# EAGLE design driver (EAGLE 9.6.2)
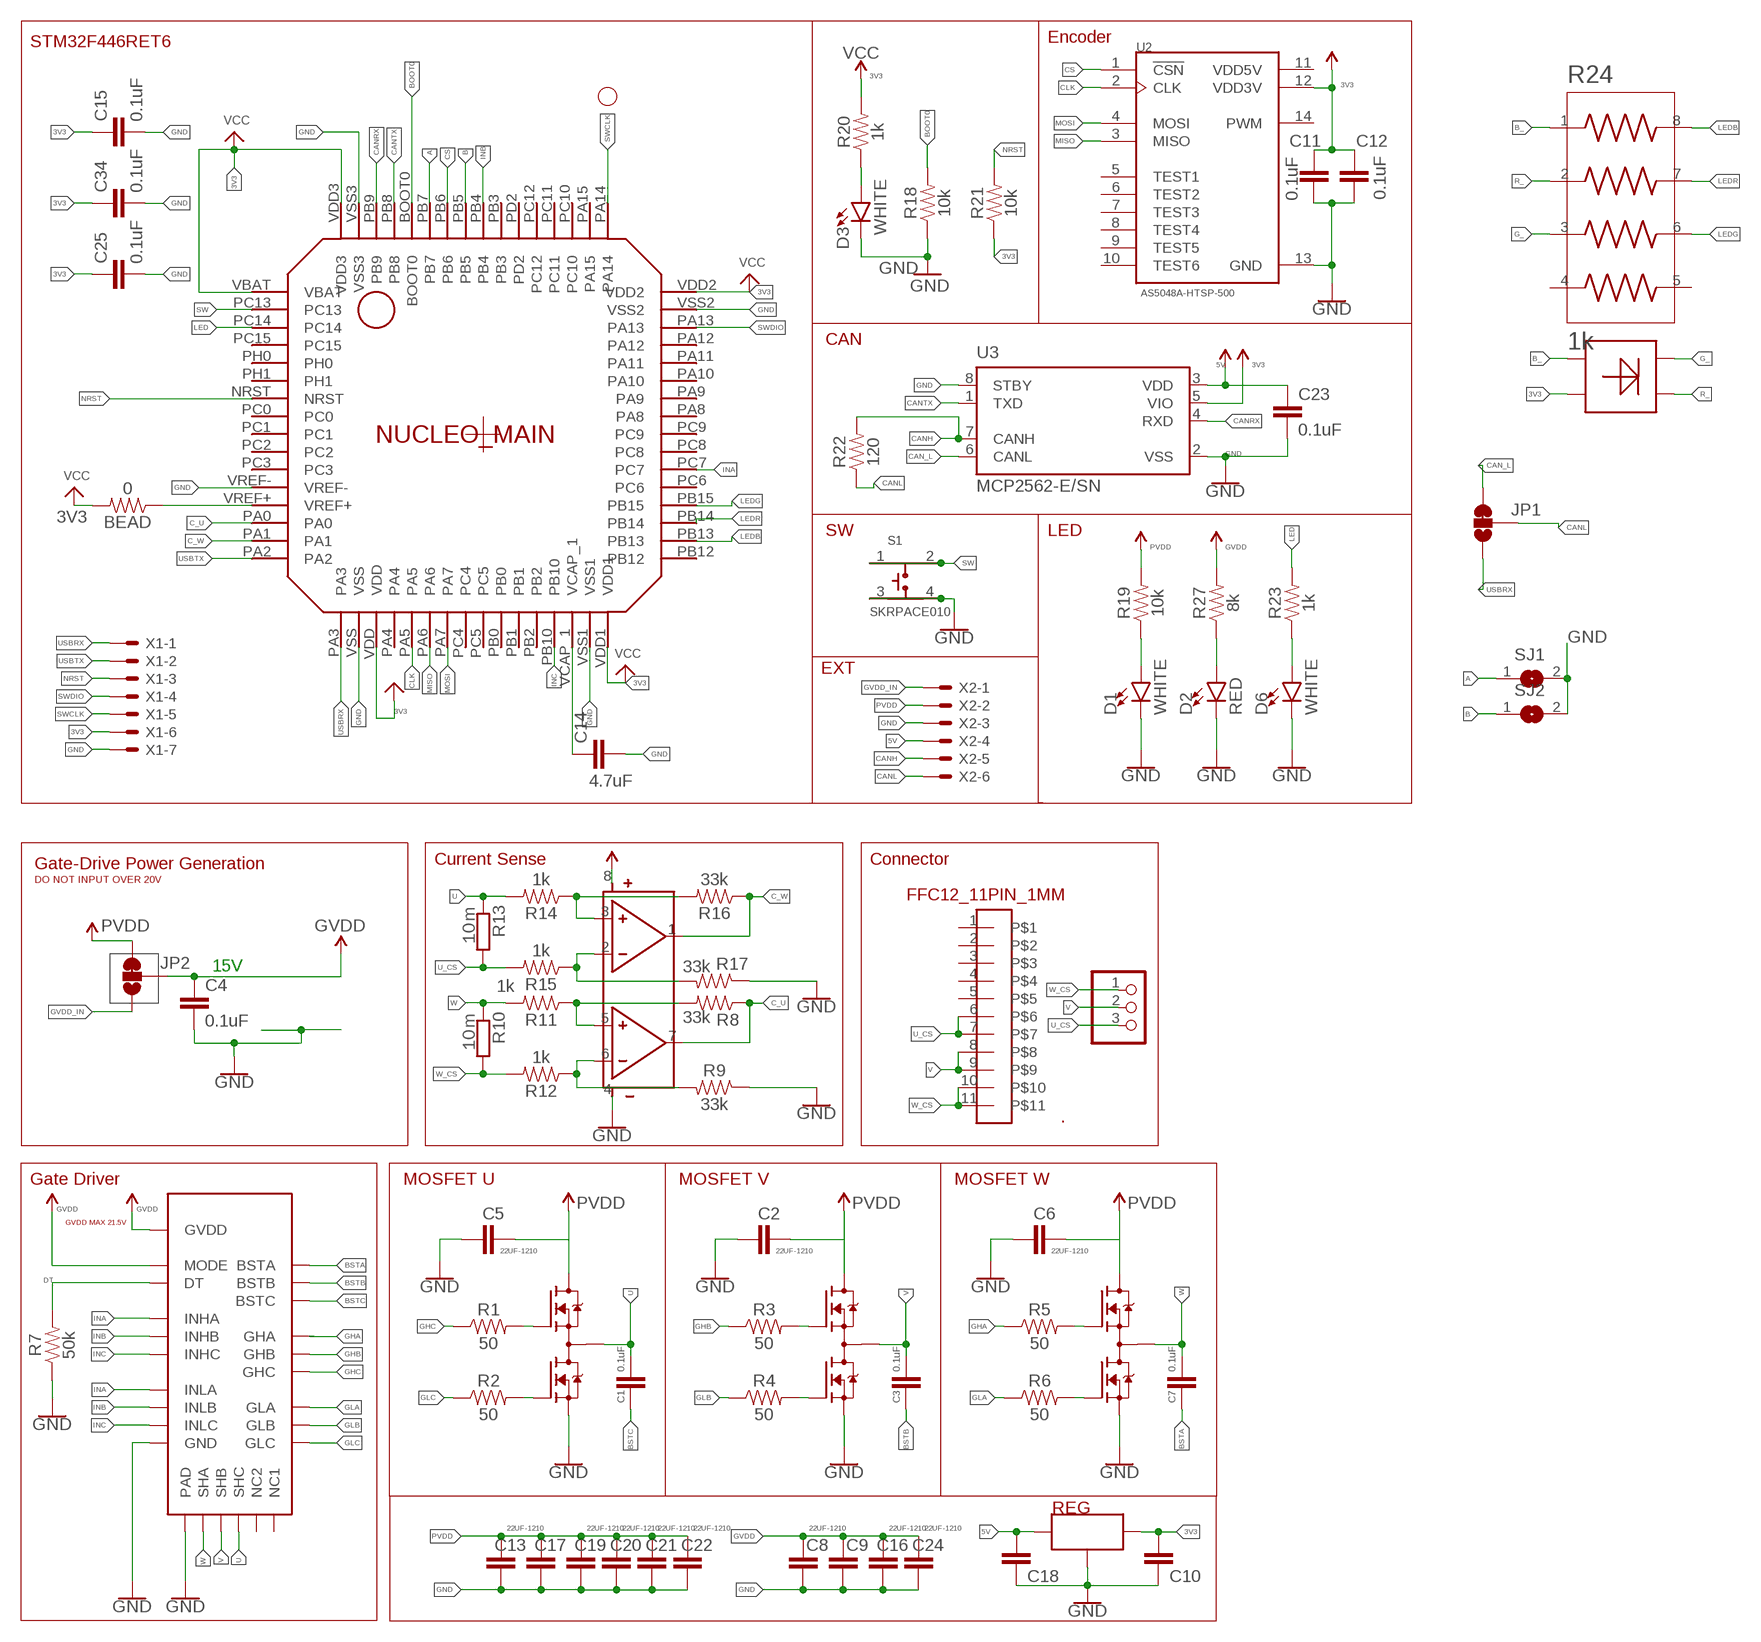
[diagram p0: schematic, sheet 1]

## Parts
.  FFC12_11PIN_1MM  [CON-SMT-FFCFPC_52207-1185]
BEAD  0  0OHM-0603-1/10W-5%  [0603]
C1  0.1uF  0.1UF-0603-25V-5%  [0603]
C2  22UF-1210  22UF-1210-16V-20%  [1210]
C3  0.1uF  0.1UF-0603-25V-5%  [0603]
C4  0.1uF  0.1UF-0603-100V-10%  [0603]
C5  22UF-1210  22UF-1210-16V-20%  [1210]
C6  22UF-1210  22UF-1210-16V-20%  [1210]
C7  0.1uF  0.1UF-0603-25V-5%  [0603]
C8  22UF-1210  22UF-1210-16V-20%  [1210]
C9  22UF-1210  22UF-1210-16V-20%  [1210]
C10  0.1UF  0.1UF_1608  [1608]
C11  0.1uF  0.1UF-0603-100V-10%  [0603]
C12  0.1uF  0.1UF-0603-100V-10%  [0603]
C13  22UF-1210  22UF-1210-16V-20%  [1210]
C14  4.7uF  0.1UF-0603-25V-(+80/-20%)  [0603]
C15  0.1uF  0.1UF-0603-25V-(+80/-20%)  [0603]
C16  22UF-1210  22UF-1210-16V-20%  [1210]
C17  22UF-1210  22UF-1210-16V-20%  [1210]
C18  0.1UF  0.1UF_1608  [1608]
C19  22UF-1210  22UF-1210-16V-20%  [1210]
C20  22UF-1210  22UF-1210-16V-20%  [1210]
C21  22UF-1210  22UF-1210-16V-20%  [1210]
C22  22UF-1210  22UF-1210-16V-20%  [1210]
C23  0.1uF  0.1UF-0603-100V-10%  [0603]
C24  22UF-1210  22UF-1210-16V-20%  [1210]
C25  0.1uF  0.1UF-0603-25V-(+80/-20%)  [0603]
C34  0.1uF  0.1UF-0603-25V-(+80/-20%)  [0603]
D1  WHITE  LED-WHITE0603  [LED-0603]
D2  RED  LED-RED0603  [LED-0603]
D3  WHITE  LED-WHITE0603  [LED-0603]
D6  WHITE  LED-WHITE0603  [LED-0603]
JP1  JUMPER-SMT_3_1-NC_TRACE_SILK  [SMT-JUMPER_3_1-NC_TRACE_SILK]
JP2  JUMPER-SMT_3_1-NC_TRACE_SILK  [SMT-JUMPER_3_1-NC_TRACE_SILK]
JP3  PINHD-1X3CB  [1X03-CLEANBIG]
NUCLEO_MAIN  F446RET6  STM32F446RET6  [STM32F446RET6]
Q2  SIZ240DT-T1-GE3  [TRANS_SIZ240DT-T1-GE3]
Q3  SIZ240DT-T1-GE3  [TRANS_SIZ240DT-T1-GE3]
Q4  SIZ240DT-T1-GE3  [TRANS_SIZ240DT-T1-GE3]
R1  50  1KOHM-0603-1/10W-1%  [0603]
R2  50  1KOHM-0603-1/10W-1%  [0603]
R3  50  1KOHM-0603-1/10W-1%  [0603]
R4  50  1KOHM-0603-1/10W-1%  [0603]
R5  50  1KOHM-0603-1/10W-1%  [0603]
R6  50  1KOHM-0603-1/10W-1%  [0603]
R7  50k  1KOHM-0603-1/10W-1%  [0603]
R8  33k  1KOHM-0603-1/10W-1%  [0603]
R9  33k  1KOHM-0603-1/10W-1%  [0603]
R10  10ｍ  SMS-REF  [SMS-REF]
R11  1k  1KOHM-0603-1/10W-1%  [0603]
R12  1k  1KOHM-0603-1/10W-1%  [0603]
R13  10ｍ  SMS-REF  [SMS-REF]
R14  1k  1KOHM-0603-1/10W-1%  [0603]
R15  1k  1KOHM-0603-1/10W-1%  [0603]
R16  33k  1KOHM-0603-1/10W-1%  [0603]
R17  33k  1KOHM-0603-1/10W-1%  [0603]
R18  10k  RESISTOR-0603-1/10W-1%  [R0603]
R19  10k  2.0KOHM-0603-1/10W-5%  [0603]
R20  1k  RESISTOR-0603-1/10W-1%  [R0603]
R21  10k  RESISTOR-0603-1/10W-1%  [R0603]
R22  120  2.0KOHM-0603-1/10W-5%  [0603]
R23  1k  2.0KOHM-0603-1/10W-5%  [0603]
R24  1k  MNR04M0APJ334  [RESCAXS50P200X100X45-8N]
R27  8k  2.0KOHM-0603-1/10W-5%  [0603]
REG  AP7333  [SOT95P237X112-3N]
S1  SKRPACE010  [SW_SKRPACE010]
SJ1  SJ  [SJ]
SJ2  SJ  [SJ]
U1  QFN50P400X400X100-25NDRV8300DRGER  [QFN50P400X400X100-25N]
U2  AS5048A-HTSP-500  [SOP65P640X120-14N]
U3  MCP2562-E/SN  [SOIC127P600X175-8N]
U4  SOP80P620X125-8N  [SOP80P620X125-8N]
U$1  LED  [LED_AAA3528LSEKJ3ZGKQBKS]
X1  JST-XH-07-PIN-ROUND-PAD  [JST-XH-07-PACKAGE-ROUND-PAD]
X2  JST-XH-06-PIN-LONG-PAD  [JST-XH-06-PACKAGE-LONG-PAD]

## Nets
3V3: BEAD.2 C10.1 C11.1 C12.1 C15.1 C25.1 C34.1 NUCLEO_MAIN.VBAT NUCLEO_MAIN.VDD NUCLEO_MAIN.VDD1 NUCLEO_MAIN.VDD2 NUCLEO_MAIN.VDD3 R20.2 R21.1 REG.2(OUT) U2.12(VDD3V) U3.5(VIO) U4.8(VDD) U$1.4(GND) X1.6 ; supply symbol labelled GVDD, PVDD, VCC
5V: C18.1 C23.1 REG.1(IN) U3.3(VDD) X2.4 ; supply symbol labelled GVDD
A: NUCLEO_MAIN.PB7 SJ1.1
B: NUCLEO_MAIN.PB5 SJ2.1
B_: R24.1 U$1.1(B)
BOOT0: NUCLEO_MAIN.BOOT0 R18.2
BSTA: C7.1 U1.BSTA
BSTB: C3.1 U1.BSTB
BSTC: C1.1 U1.BSTC
C_U: NUCLEO_MAIN.PA0 R8.1 U4.7(O2)
C_W: NUCLEO_MAIN.PA1 R16.1 U4.1(O1)
CAN_L: JP1.3 U3.6(CANL)
CANH: R22.2 U3.7(CANH) X2.5
CANL: JP1.2 R22.1 X2.6
CANRX: NUCLEO_MAIN.PB9 U3.4(RXD)
CANTX: NUCLEO_MAIN.PB8 U3.1(TXD)
CLK: NUCLEO_MAIN.PA5 U2.2(CLK)
CS: NUCLEO_MAIN.PB6 U2.1(!CSN)
DT: R7.2 U1.DT
G_: R24.3 U$1.2(G)
GHA: R5.1 U1.GHA
GHB: R3.1 U1.GHB
GHC: R1.1 U1.GHC
GLA: R6.1 U1.GLA
GLB: R4.1 U1.GLB
GLC: R2.1 U1.GLC
GND: C2.1 C4.2 C5.1 C6.1 C8.1 C9.1 C10.2 C11.2 C12.2 C13.1 C14.2 C15.2 C16.1 C17.1 C18.2 C19.1 C20.1 C21.1 C22.1 C23.2 C24.1 C25.2 C34.2 D1.C D2.C D3.C D6.C NUCLEO_MAIN.VREF- NUCLEO_MAIN.VSS NUCLEO_MAIN.VSS1 NUCLEO_MAIN.VSS2 NUCLEO_MAIN.VSS3 Q2.5(S2) Q2.6(S2) Q2.7(S2) Q3.5(S2) Q3.6(S2) Q3.7(S2) Q4.5(S2) Q4.6(S2) Q4.7(S2) R7.1 R9.1 R17.1 R18.1 REG.3(GND) S1.3 S1.4 SJ1.2 SJ2.2 U1.GND U1.PAD U2.13(GND) U3.2(VSS) U3.8(STBY) U4.4(GND) X1.7 X2.3
GVDD: C4.1 C8.2 C9.2 C16.2 C24.2 JP2.2 R27.2 U1.GVDD U1.MODE ; supply symbol labelled PVDD
GVDD_IN: JP2.1 X2.1
HA: Q4.1(G1) R5.2
HB: Q3.1(G1) R3.2
HC: Q2.1(G1) R1.2
INA: NUCLEO_MAIN.PC7 U1.INHA U1.INLA
INB: NUCLEO_MAIN.PB4 U1.INHB U1.INLB
INC: NUCLEO_MAIN.PB10 U1.INHC U1.INLC
L: D3.A R20.1
LA: Q4.8(G2) R6.2
LB: Q3.8(G2) R4.2
LC: Q2.8(G2) R2.2
LED: NUCLEO_MAIN.PC14 R23.2
LEDB: NUCLEO_MAIN.PB13 R24.8
LEDG: NUCLEO_MAIN.PB15 R24.6
LEDR: NUCLEO_MAIN.PB14 R24.7
MISO: NUCLEO_MAIN.PA6 U2.3(MISO)
MOSI: NUCLEO_MAIN.PA7 U2.4(MOSI)
N$8: R8.2 R11.1 U4.5(P2)
N$9: R9.2 R12.1 U4.6(M2)
N$10: R14.1 R16.2 U4.3(P1)
N$11: R15.1 R17.2 U4.2(M1)
N$14: D1.A R19.1
N$15: D2.A R27.1
N$21: D6.A R23.1
NRST: NUCLEO_MAIN.NRST R21.2 X1.3
PVDD: C2.2 C5.2 C6.2 C13.2 C17.2 C19.2 C20.2 C21.2 C22.2 JP2.3 Q2.2(D1) Q2.3(D1) Q2.4(D1) Q2.10(D1) Q3.2(D1) Q3.3(D1) Q3.4(D1) Q3.10(D1) Q4.2(D1) Q4.3(D1) Q4.4(D1) Q4.10(D1) R19.2 X2.2 ; supply symbol labelled GVDD
R_: R24.2 U$1.3(R)
SW: NUCLEO_MAIN.PC13 S1.1 S1.2
SWCLK: NUCLEO_MAIN.PA14 X1.5
SWDIO: NUCLEO_MAIN.PA13 X1.4
U: C1.2 Q2.9(S1/D2) R13.2 R14.2 U1.SHC
U_CS: ..6 ..7 JP3.3 R13.1 R15.2
USBRX: JP1.1 NUCLEO_MAIN.PA3 X1.1
USBTX: NUCLEO_MAIN.PA2 X1.2
V: ..8 ..9 C3.2 JP3.2 Q3.9(S1/D2) U1.SHB
VCAP: C14.1 NUCLEO_MAIN.VCAP_1
VDDA: BEAD.1 NUCLEO_MAIN.VREF+
W: C7.2 Q4.9(S1/D2) R10.2 R11.2 U1.SHA
W_CS: ..10 ..11 JP3.1 R10.1 R12.2
Unconnected: ..1 ..2 ..3 ..4 ..5 NUCLEO_MAIN.PA4 NUCLEO_MAIN.PA8 NUCLEO_MAIN.PA9 NUCLEO_MAIN.PA10 NUCLEO_MAIN.PA11 NUCLEO_MAIN.PA12 NUCLEO_MAIN.PA15 NUCLEO_MAIN.PB0 NUCLEO_MAIN.PB1 NUCLEO_MAIN.PB2 NUCLEO_MAIN.PB3 NUCLEO_MAIN.PB12 NUCLEO_MAIN.PC0 NUCLEO_MAIN.PC1 NUCLEO_MAIN.PC2 NUCLEO_MAIN.PC3 NUCLEO_MAIN.PC4 NUCLEO_MAIN.PC5 NUCLEO_MAIN.PC6 NUCLEO_MAIN.PC8 NUCLEO_MAIN.PC9 NUCLEO_MAIN.PC10 NUCLEO_MAIN.PC11 NUCLEO_MAIN.PC12 NUCLEO_MAIN.PC15 NUCLEO_MAIN.PD2 NUCLEO_MAIN.PH0 NUCLEO_MAIN.PH1 R24.4 R24.5 U1.NC1 U1.NC2 U2.5(TEST1) U2.6(TEST2) U2.7(TEST3) U2.8(TEST4) U2.9(TEST5) U2.10(TEST6) U2.14(PWM)

## Notes on the sheet
- STM32F446RET6 | Encoder
- CAN
- SW | LED
- Recommended
- EXT
- Gate-Drive Power Generation | Current Sense | Connector
- DO NOT INPUT OVER 20V
- 15V
- Gate Driver | MOSFET U | MOSFET V | MOSFET W
- GVDD MAX 21.5V

## Power pins joined to a net without a drawn wire
VDD5V: U2.11(VDD5V)

## Library data of the parts
. = MotorDriver_FourthEdition_prot:FFC12_11PIN_1MM
BEAD = SparkFun-Resistors:0OHM: 0Ω resistor A resistor is a passive two-terminal electrical component that implements electrical resistance as a circuit element. Resistors act to reduce current flow, and, at the same time, act to lower voltage levels within circuits. - Wikipedia; PROD_ID: RES-08609
C1 C3 C7 = SparkFun-Capacitors:0.1UF: 0.1µF ceramic capacitors A capacitor is a passive two-terminal electrical component used to store electrical energy temporarily in an electric field.; PROD_ID: CAP-08604
C2 C5 C6 C8 C9 C13 C16 C17 C19-C22 C24 = SparkFun-Capacitors:22UF: 22µF ceramic capacitors A capacitor is a passive two-terminal electrical component used to store electrical energy temporarily in an electric field.
C4 C11 C12 C23 = SparkFun-Capacitors:0.1UF: 0.1µF ceramic capacitors A capacitor is a passive two-terminal electrical component used to store electrical energy temporarily in an electric field.; PROD_ID: CAP-08390
C10 C18 = Custom_Designed_By_Yusei:0.1UF_1608
C14 = SparkFun-Capacitors:0.1UF: 0.1µF ceramic capacitors A capacitor is a passive two-terminal electrical component used to store electrical energy temporarily in an electric field.; PROD_ID: CAP-00810; VALUE: 0.1uF
C15 C25 C34 = SparkFun-Capacitors:0.1UF: 0.1µF ceramic capacitors A capacitor is a passive two-terminal electrical component used to store electrical energy temporarily in an electric field.; PROD_ID: CAP-00810
D1 D3 D6 = SparkFun-LED:LED-WHITE: White SMD LED Used in manufacturing several products at SparkFun. Packages: 0603 - Bright White SMD 0603 package[Product Link] <http://www.kingbrightusa.com/product.asp?catalog_name=LED&product_id=APT1608QWF/D> 1206 - Bright White SMD1206 package [Product Link] <http://www.kingbrightusa.com/product.asp?catalog_name=LED&product_id=APT3216QWF/D> 3014 - Super Bright SMD 3014 package [Datasheet] <http://www.lumileds.com/uploads/459/DS208-pdf> SparkFun Products: Blackberry Trackballer Breakout <https://www.sparkfun.com/products/13169> Digital SandBox <https://www.sparkfun.com/products/12651>; PROD_ID: DIO-09004
D2 = SparkFun-LED:LED-RED: Red SMD LED Used in manufacturing of most products at SparkFun Packages: 0603 - SMD 0603 package [Product Link] <http://docs.avagotech.com/docs/AV02-0551EN> 0603 SMART - SMD 0603 SMART package ( more efficient and expensive)[Product Link] <http://www.osram-os.com/Graphics/XPic2/00077099_0.pdf> 1206 - SMD1206 package [Product Link] <https://www.sparkfun.com/datasheets/DevTools/LilyPad/Q150OVS4.pdff> SparkFun Products: Pro Mini 328 -5V <https://www.sparkfun.com/products/821> RedBoard <https://www.sparkfun.com/products/12757> IOIO-OTG <https://www.sparkfun.com/products/13613>; PROD_ID: DIO-00819
JP1 JP2 = SparkFun-Jumpers:JUMPER-SMT_3_1-NC_TRACE: Normally closed trace jumper (1 of 2 connections) This jumper has a trace between two pads so it's normally closed (NC). The other connection is normally open (NO). Use a razor knife to open the connection. For best results follow the IPC guidelines for cutting traces: Cutout at least 0.063 mm (0.005 in). Remove all loose material to clean up the cut area. Seal the cut with an approved epoxy. Reapply solder to reclose the connection, or to close the NO connection.
JP3 = adafruit:PINHD-1X3: PIN HEADER
NUCLEO_MAIN = STM32F446RET6:STM32F446RET6
Q2-Q4 = SIZ240DT-T1-GE3:SIZ240DT-T1-GE3: Check availability <https://pricing.snapeda.com/parts/SIZ240DT-T1-GE3/Vishay%20Siliconix/view-part?ref=eda>; AVAILABILITY: In Stock; DESCRIPTION: Mosfet Array 2 N-Channel (Dual) 40V 17.2A (Ta), 48A (Tc), 16.9A (Ta), 47A (Tc) 4.3W (Ta), 33W (Tc) Surface Mount 8-PowerPair® (3.3x3.3); MF: Vishay Siliconix; MP: SIZ240DT-T1-GE3; PACKAGE: PowerWDFN-8 Vishay Siliconix; PRICE: None; PURCHASE-URL: https://pricing.snapeda.com/search/part/SIZ240DT-T1-GE3/?ref=eda
R1-R9 R16 R17 = SparkFun-Resistors:1KOHM: 1kΩ resistor A resistor is a passive two-terminal electrical component that implements electrical resistance as a circuit element. Resistors act to reduce current flow, and, at the same time, act to lower voltage levels within circuits. - Wikipedia; PROD_ID: RES-07856; VALUE: 1k
R10 R13 = resistor-shunt:SMS-REF: SMD SHUNT RESISTOR; OC_FARNELL: unknown; OC_NEWARK: unknown
R11 R12 R14 R15 = SparkFun-Resistors:1KOHM: 1kΩ resistor A resistor is a passive two-terminal electrical component that implements electrical resistance as a circuit element. Resistors act to reduce current flow, and, at the same time, act to lower voltage levels within circuits. - Wikipedia; PROD_ID: RES-07856
R18 R21 = Custom_Designed_By_Yusei:RESISTOR: Resistor; PROD_ID: RES-07856; VALUE: 1k
R19 R22 R23 R27 = SparkFun-Resistors:2.0KOHM: 2kΩ resistor A resistor is a passive two-terminal electrical component that implements electrical resistance as a circuit element. Resistors act to reduce current flow, and, at the same time, act to lower voltage levels within circuits. - Wikipedia; PROD_ID: RES-08296; VALUE: 2.0k
R20 = Custom_Designed_By_Yusei:RESISTOR: Resistor; PROD_ID: RES-07856
R24 = MNR04M0APJ334:MNR04M0APJ334: Res Array 330K Ohm 5% ±200ppm/°C ISOL Epoxy 8-Pin 0804(4 X 0402) Convex SMD Automotive T/R Check availability <https://pricing.snapeda.com/parts/MNR04M0APJ334/Rohm/view-part?ref=eda>; AVAILABILITY: In Stock; DESCRIPTION: Res Array 330K Ohm 5% ±200ppm/°C ISOL Epoxy 8-Pin 0804(4 X 0402) Convex SMD Automotive T/R; MF: Rohm; MP: MNR04M0APJ334; PACKAGE: 0402 Rohm; PRICE: None
REG = SOT95P237X112-3N:AP7333
S1 = Alps SW:SKRPACE010: Switch Tactile N.O. SPST Button J-Bend 0.05A 16VDC 2.55N SMD Automotive T/R; AVAILABILITY: Good; DESCRIPTION: Switch Tactile N.O. SPST Button J-Bend 0.05A 16VDC 2.55N SMD Automotive T/R; MF: ALPS; MP: SKRPACE010; PACKAGE: None; PRICE: 0.29 USD
SJ1 SJ2 = jumper:SJ: SMD solder JUMPER
U1 = DRV8300DRGER:QFN50P400X400X100-25N: DRV8300
U2 = AS5048A-HTSP-500:AS5048A-HTSP-500: AS5048B Series 360° 3.3 / 5 V 14 bit Magnetic Rotary Encoder - TSSOP-14 Check availability <https://pricing.snapeda.com/parts/AS5048A-HTSP-500/ams/view-part?ref=eda>; AVAILABILITY: In Stock; DESCRIPTION: Hall Effect Sensor Angle External Magnet, Not Included Gull Wing; MF: ams; MP: AS5048A-HTSP-500; PACKAGE: TSSOP-14 ams; PRICE: None; PURCHASE-URL: https://pricing.snapeda.com/search/part/AS5048A-HTSP-500/?ref=eda
U3 = MCP2562-E_SN:MCP2562-E/SN: MCP2562 Series 5 V Surface Mount High-Speed CAN Transceiver - SOIC-8 Check availability <https://pricing.snapeda.com/parts/MCP2562-E/SN/Microchip/view-part?ref=eda>; AVAILABILITY: In Stock; DESCRIPTION: 1/1 Transceiver Half CANbus 8-SOIC; MF: Microchip; MP: MCP2562-E/SN; PACKAGE: SO-8 Microchip; PRICE: None; PURCHASE-URL: https://pricing.snapeda.com/search/part/MCP2562-E/SN/?ref=eda
U4 = NJM2732:SOP80P620X125-8N; A1_MIN: 0.0; A_MAX: 1.25; A_MIN: 1.25; A_NOM: 1.25; B_MAX: 0.35; B_MIN: 0.35; B_NOM: 0.35; D2_MAX: 0.0; D_MAX: 3.5; D_MIN: 3.5; D_NOM: 3.5; E1_MAX: 4.2; E1_MIN: 4.2; E1_NOM: 4.2; E2_MAX: 0.0; ENOM: 0.8; E_MAX: 6.2; E_MIN: 6.2; E_NOM: 6.2; L_MAX: 0.5; L_MIN: 0.5; L_NOM: 0.5; MANUFACTURER: New Japan Radio; PIN_COUNT: 8.0; SNAPEDA_PACKAGE_ID: 11524; STANDARD: IPC 7351B
U$1 = LED_AAA3528LSEKJ3ZGKQBKS:LED
X1 = JST XH Connectors:JST-XH-07-PIN: JST XH Connector 2 Pin Wire to board connector. Pitch: 2,54 mm, (0.100") Number of pins: 7 Created by Rembrandt Electronics www.rembrandtelectronics.com
X2 = Rembrandt Electronics - JST XH Connectors v1-0:JST-XH-06-PIN: JST XH Connector 2 Pin Wire to board connector. Pitch: 2,54 mm, (0.100") Number of pins: 6 Created by Rembrandt Electronics www.rembrandtelectronics.com

## Net classes
0 default: width 0.3 mm

## Board
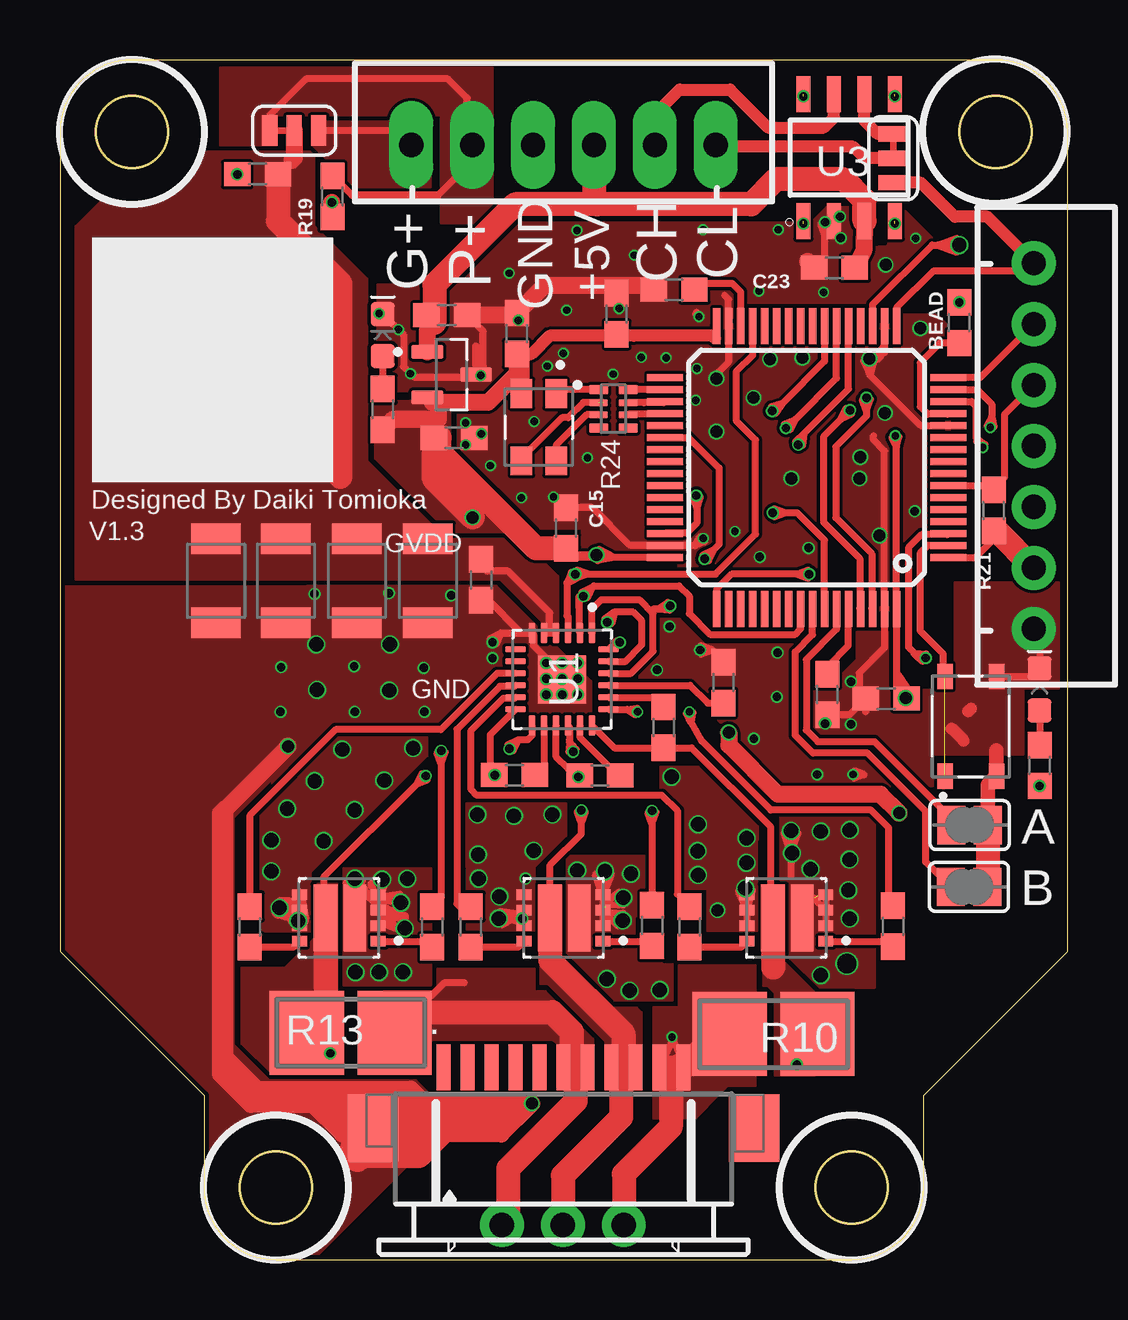
[diagram p1: board, top side]
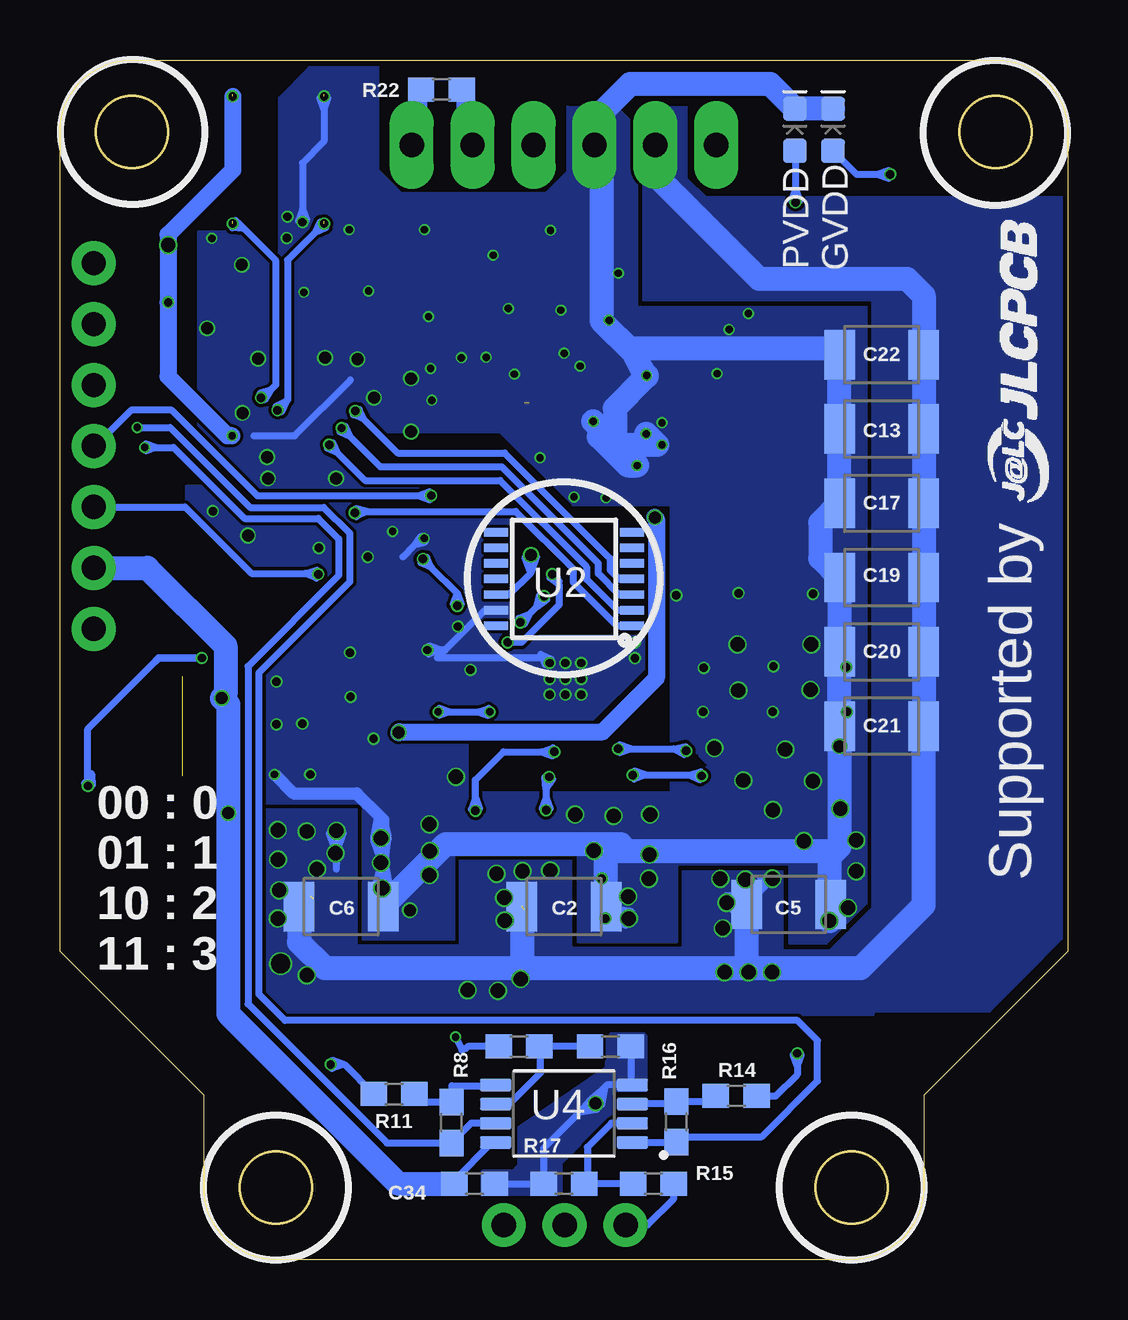
[diagram p2: board, bottom side, seen from below]

Size 42 x 50 mm. Coordinates in mm from the lower left corner, seen from the top.
Outline: 3,50 arc90 0,47 0,12.85 6,6.85 6,3 arc90 9,0 33,0 arc90 36,3 36,6.85 42,12.85 42,47 arc90 39,50 3,50
Outline: circle at 3,47 radius 1.5
Outline: circle at 39,47 radius 1.5
Outline: circle at 9,3 radius 1.5
Outline: circle at 33,3 radius 1.5
Outline: circle at 39,47 radius 1.5
Copper layers (1*16): Top 0.035mm / dielectric 1.6mm / Bottom 0.035mm
Design rules "jlcpcb-2layers": minimum track width 5mil, minimum drill 0.3mm, track to track 5mil, track to pad 5mil, pad to pad 5mil, via to via 5mil, smd to smd 5mil, copper to edge 0.2mm, drill to drill 6mil, minimum pad ring 10mil, minimum via ring 3mil, stop-mask expansion 4mil, vias tented up to drill 0mil, thermal gap 10mil
tRestrict: area 6,0 to 12,6; area 30,0 to 36,6; area 0,44 to 6,50; area 36,44 to 42,50; 5 lines
bRestrict: area 0,44 to 6,50; area 36,44 to 42,50; 2 lines

### Footprints (pad centres in the part's own frame; a part is rotated, then mirrored left to right if it is on the bottom)
CON-SMT-FFCFPC_52207-1185 = smd 0.6 x 1.9: 1 -5,2.5; 2 -4,2.5; 3 -3,2.5; 4 -2,2.5; 5 -1,2.5; 6 0,2.5; 7 1,2.5; 8 2,2.5; 9 3,2.5; 10 4,2.5; 11 5,2.5 | smd 2.1 x 2.8: P$1 -7.93,-0.03; P$4 7.945,-0.03
0603 = smd 1.1 x 1: 1 -0.85,0; 2 0.85,0
1210 = smd 1.27 x 2.06: 1 -1.755,0; 2 1.755,0
1608 = smd 1.1 x 1: 1 -0.85,0; 2 0.85,0
LED-0603 = smd 1 x 1: A -0.877,0; C 0.877,0
SMT-JUMPER_3_1-NC_TRACE_SILK = smd 0.635 x 1.27: 1 -1.016,0; 2 0,0; 3 1.016,0
1X03-CLEANBIG = drill 1.016 pad 1.676: 1 -2.54,0; 2 0,0; 3 2.54,0
STM32F446RET6 = smd 0.3 x 1.5: BOOT0 -1.75,5.9; PA3 -3.75,-5.9; PA4 -2.25,-5.9; PA5 -1.75,-5.9; PA6 -1.25,-5.9; PA7 -0.75,-5.9; PA14 3.75,5.9; PA15 3.25,5.9; PB0 0.75,-5.9; PB1 1.25,-5.9; PB2 1.75,-5.9; PB3 0.75,5.9; PB4 0.25,5.9; PB5 -0.25,5.9; PB6 -0.75,5.9; PB7 -1.25,5.9; PB8 -2.25,5.9; PB9 -2.75,5.9; PB10 2.25,-5.9; PC4 -0.25,-5.9; PC5 0.25,-5.9; PC10 2.75,5.9; PC11 2.25,5.9; PC12 1.75,5.9; PD2 1.25,5.9; VCAP_1 2.75,-5.9; VDD -2.75,-5.9; VDD1 3.75,-5.9; VDD3 -3.75,5.9; VSS -3.25,-5.9; VSS1 3.25,-5.9; VSS3 -3.25,5.9 | smd 1.5 x 0.3: NRST -5.9,0.75; PA0 -5.9,-2.75; PA1 -5.9,-3.25; PA2 -5.9,-3.75; PA8 5.9,0.25; PA9 5.9,0.75; PA10 5.9,1.25; PA11 5.9,1.75; PA12 5.9,2.25; PA13 5.9,2.75; PB12 5.9,-3.75; PB13 5.9,-3.25; PB14 5.9,-2.75; PB15 5.9,-2.25; PC0 -5.9,0.25; PC1 -5.9,-0.25; PC2 -5.9,-0.75; PC3 -5.9,-1.25; PC6 5.9,-1.75; PC7 5.9,-1.25; PC8 5.9,-0.75; PC9 5.9,-0.25; PC13 -5.9,3.25; PC14 -5.9,2.75; PC15 -5.9,2.25; PH0 -5.9,1.75; PH1 -5.9,1.25; VBAT -5.9,3.75; VDD2 5.9,3.75; VREF+ -5.9,-2.25; VREF- -5.9,-1.75; VSS2 5.9,3.25
TRANS_SIZ240DT-T1-GE3 = smd 0.62 x 0.44: 1 -1.64,0.975; 2 -1.64,0.325; 3 -1.64,-0.325; 4 -1.64,-0.975; 5 1.64,-0.975; 6 1.64,-0.325; 7 1.64,0.325; 8 1.64,0.975 | smd 1.005 x 2.8: 9 0.557,0 | smd 0.935 x 2.8: 10 -0.662,0
SMS-REF = smd 3.1 x 3.5: 1 1.829,0; 2 -1.829,0
R0603 = smd 1.1 x 1: 1 -0.85,0; 2 0.85,0
RESCAXS50P200X100X45-8N = smd 0.79 x 0.39: 1 -0.62,0.8; 4 -0.62,-0.8; 5 0.62,-0.8; 8 0.62,0.8 | smd 0.79 x 0.29: 2 -0.62,0.25; 3 -0.62,-0.25; 6 0.62,-0.25; 7 0.62,0.25
SOT95P237X112-3N = smd 1.32 x 0.59: 1 -1.015,0.95; 2 -1.015,-0.95; 3 1.015,0
SW_SKRPACE010 = smd 1.05 x 0.65: 1 -2.075,1.075; 2 2.075,1.075; 3 -2.075,-1.075; 4 2.075,-1.075
SJ = smd 1.168 x 1.6: 1 -0.762,0; 2 0.762,0
QFN50P400X400X100-25N = smd 0.27 x 0.86: BSTA 0.75,1.935; DT 0.25,1.935; GHA 1.25,1.935; GLA 0.75,-1.935; GLB 0.25,-1.935; GLC -0.25,-1.935; INHA -0.25,1.935; INHB -0.75,1.935; INHC -1.25,1.935; NC1 -1.25,-1.935; NC2 -0.75,-1.935; SHC 1.25,-1.935 | smd 0.86 x 0.27: BSTB 1.935,0.75; BSTC 1.935,-0.75; GHB 1.935,0.25; GHC 1.935,-1.25; GND -1.935,-1.25; GVDD -1.935,-0.25; INLA -1.935,1.25; INLB -1.935,0.75; INLC -1.935,0.25; MODE -1.935,-0.75; SHA 1.935,1.25; SHB 1.935,-0.25 | smd 2 x 2: PAD 0,0
SOP65P640X120-14N = smd 1 x 0.35: 1 -2.825,1.95; 2 -2.825,1.3; 3 -2.825,0.65; 4 -2.825,0; 5 -2.825,-0.65; 6 -2.825,-1.3; 7 -2.825,-1.95; 8 2.825,-1.95; 9 2.825,-1.3; 10 2.825,-0.65; 11 2.825,0; 12 2.825,0.65; 13 2.825,1.3; 14 2.825,1.95
SOIC127P600X175-8N = smd 1.5 x 0.6: 1 -2.65,1.905; 2 -2.65,0.635; 3 -2.65,-0.635; 4 -2.65,-1.905; 5 2.65,-1.905; 6 2.65,-0.635; 7 2.65,0.635; 8 2.65,1.905
SOP80P620X125-8N = smd 1.31 x 0.52: 1 -2.85,1.2; 2 -2.85,0.4; 3 -2.85,-0.4; 4 -2.85,-1.2; 5 2.85,-1.2; 6 2.85,-0.4; 7 2.85,0.4; 8 2.85,1.2
LED_AAA3528LSEKJ3ZGKQBKS = smd 1.2 x 0.9: 1 -1.4,0.725; 2 1.4,0.725; 3 1.4,-0.725; 4 -1.4,-0.725
JST-XH-07-PACKAGE-ROUND-PAD = drill 1.016: 1 -7.62,0; 2 -5.08,0; 3 -2.54,0; 4 0,0; 5 2.54,0; 6 5.08,0; 7 7.62,0
JST-XH-06-PACKAGE-LONG-PAD = drill 1.016 long: 1 -6.35,0; 2 -3.81,0; 3 -1.27,0; 4 1.27,0; 5 3.81,0; 6 6.35,0

### Placement (x,y rotation side)
.  20.99,5.51 0 top
BEAD  37.49,39.05 90 top
C1  18.95,20.19 180 top
C2  20.99,14.72 180 bottom
C3  22.51,20.18 180 top
C4  17.55,28.33 270 top
C5  11.62,14.8 180 bottom
C6  30.28,14.72 180 bottom
C7  25.16,22.18 270 top
C8  15.34,28.29 90 top
C9  12.38,28.29 90 top
C10  16.43,34.25 0 top
C11  34.44,23.39 180 top
C12  19.05,38.6 90 top
C13  7.75,34.62 0 bottom
C14  25.6,40.43 180 top
C15  21.1,30.49 90 top
C16  9.42,28.29 90 top
C17  7.75,31.52 0 bottom
C18  16.13,39.36 0 top
C19  7.75,28.43 0 bottom
C20  7.75,25.33 0 bottom
C21  7.75,22.23 0 bottom
C22  7.75,37.71 0 bottom
C23  32.28,41.33 180 top
C24  6.51,28.29 90 top
C25  23.21,39.41 90 top
C34  24.72,3.16 0 bottom
D1  11.36,47.09 90 bottom
D2  9.78,47.09 90 bottom
D3  13.45,38.53 90 top
D6  40.83,23.77 90 top
JP1  34.74,45.9 90 top
JP2  9.76,47.06 180 top
JP3  20.96,1.44 180 top
NUCLEO_MAIN  31.12,33.01 180 top
Q2  11.62,14.24 180 top
Q3  20.99,14.24 180 top
Q4  30.28,14.24 180 top
R1  15.52,13.87 270 top
R2  7.91,13.87 270 top
R3  24.68,13.92 270 top
R4  17.12,13.87 270 top
R5  34.72,13.89 270 top
R6  26.25,13.87 270 top
R7  27.65,24.05 270 top
R8  25.67,5.71 90 bottom
R9  19.06,8.88 180 bottom
R10  29.74,9.4 180 top
R11  28.07,6.91 180 bottom
R12  22.87,8.88 180 bottom
R13  12.12,9.46 0 top
R14  13.81,6.82 0 bottom
R15  17.26,3.16 0 bottom
R16  16.31,5.74 90 bottom
R17  20.99,3.16 0 bottom
R18  31.98,23.55 90 top
R19  11.36,44.31 90 top
R20  13.45,35.44 270 top
R21  38.93,31.23 90 top
R22  26.1,48.77 0 bottom
R23  40.83,20.59 270 top
R24  23.07,35.46 0 top
R27  8.24,45.24 0 top
REG  16.33,36.89 0 top
S1  37.96,22.22 90 top
SJ1  37.92,18.11 0 top
SJ2  37.89,15.53 0 top
U1  20.93,24.19 270 top
U2  20.99,28.37 180 bottom
U3  32.9,45.93 90 top
U4  20.99,6.08 180 bottom
U$1  19.96,34.69 270 top
X1  40.6,33.91 270 top
X2  20.99,46.47 0 top

### Tracks (layer width: path | path; a pad name or v marks a point on that pad's centre or on a via)
3V3  (via drill 0.3, 0.35, 0.5, 0.6)  (1 unrouted)
  Top 0.3: R21.1 39.07,30.23 39.13,30.23 38.16,29.27 NUCLEO_MAIN.VBAT | NUCLEO_MAIN.VDD1 27.37,38.45 27.31,38.39 | 15.78,35.67 15.73,35.72 | 15.53,35.72 REG.2 | 15.83,34.25 C10.1 | NUCLEO_MAIN.VDD2 23.11,29.27 | 23.11,29.27 21.47,29.27 C15.1 21.4,29.37 v22.37,29.37 | v34.83,34.34 34.87,34.29 34.87,33.88 | 34.87,33.88 NUCLEO_MAIN.VDD3 34.87,24.46 | 34.87,24.46 34.87,23.8 C11.1 | NUCLEO_MAIN.VDD 33.88,38.93 33.88,39.81 36.35,42.28 36.59,42.28 | 36.59,42.28 v37.49,42.28 | 23.11,29.27 22.48,29.6 v22.37,29.37 | 23.11,29.27 22.42,29.13 v22.37,29.37 | 34.87,33.88 34.98,34.3 v34.83,34.34 | 34.87,33.88 34.69,34.27 v34.83,34.34 | 35.07,24.18 35.02,23.42 v35.25,23.41 35.49,23.57 35.07,24.18 | 34.87,24.46 35.07,24.18 | 36.59,42.28 37.39,42 v37.49,42.28 | 36.59,42.28 37.39,42.57 v37.49,42.28 | C25.1 23.85,38.56 23.91,38.51
  Top 0.5: C12.1 19.65,37.75 20.41,38.51 23.91,38.51 27.19,38.51 27.31,38.39 | U$1.4 19.23,36.29
  Top 0.7: C10.1 15.58,35.03 | 15.78,35.67 15.78,35.03 15.58,35.03 | R20.2 13.89,35.03 15.58,35.03 | 15.53,35.72 15.73,35.72 17.84,35.72 19.05,36.93 C12.1 19.23,37.57 U$1.4 | v34.98,18.61 34.2,19.39 29.93,19.39 27.88,21.45 v27.88,21.97
  Top 1: v35.25,23.41 35.29,23.41 C11.1 | 15.83,33.43 15.83,34.25 | v17.2,30.93 15.58,32.56 C10.1 15.58,33.91 19.85,29.64 C15.1 | X1.6 39.05,30.38 R21.1
  Bottom 0.3: C34.1 25.57,3.29 23.98,4.88 U4.8 | U2.12 23.28,27.72 22.37,28.62 | 22.37,28.62 22.37,28.63 v22.37,29.37 | 22.37,28.62 22.6,29.29 v22.37,29.37 | 22.37,28.62 22.13,29.29 v22.37,29.37
  Bottom 0.7: v27.88,21.97 27.85,22 19.38,22 17.14,24.23 17.14,30.88 v17.2,30.93 | v34.8,48.48 34.8,45.42 37.49,42.73 v37.49,42.28 BEAD.2 37.49,36.8 35.03,34.34 v34.83,34.34
  Bottom 1: C34.1 27.9,3.16 34.99,10.25 v34.99,18.6 v34.98,18.61 34.98,23.14 v35.25,23.41 35.1,23.55 35.1,25.57 38.35,28.83 X1.6
  other vias: 37.49,39.9
  pour Top (no thermals): 13.13,35.77 13.13,33.39 16.19,30.32 19.61,30.32 19.61,30.46 16.26,33.81 16.26,35.77
5V
  Top 0.3: C18.1 15.7,38.94
  Top 0.7: 15.7,38.94 15.7,39.71 15.61,39.62 15.61,39.03 15.31,38.73 REG.1 | U3.3 33.51,42.05 C23.1
  Top 1: U3.3 33.53,44.16 32.67,45.02 29.85,45.02 28.82,43.99 22.39,43.99 | 15.61,39.03 15.61,40.63 18.97,43.99 22.39,43.99 | X2.4 22.26,44.12 22.29,44.09 22.39,43.99 | 22.39,43.99
A
  Top 0.3: SJ1.1 37.16,18.38 33.95,21.59 31.59,21.59 31.11,22.07 31.11,25.01 32.37,26.27 NUCLEO_MAIN.PB7
B
  Top 0.3: SJ2.1 36.09,16.57 36.09,18.68 33.66,21.11 31.39,21.11 30.65,21.85 30.65,25.33 31.37,26.05 NUCLEO_MAIN.PB5
B_
  Top 0.3: 20.92,36.33 U$1.1 20.85,36.26 R24.1
BOOT0
  Top 0.3: NUCLEO_MAIN.BOOT0 32.85,27.1 32.85,25.58 31.98,24.71 R18.2
BSTA
  Top 0.3: C7.1 24.75,23.44 U1.BSTA
BSTB
  Top 0.3: C3.1 23.27,20.27 23.17,20.27 21.68,21.76 U1.BSTB
BSTC
  Top 0.3: C1.1 20.18,20.58 U1.BSTC
C_U  (via drill 0.3)
  Top 0.3: NUCLEO_MAIN.PA0 37.99,35.77 38.18,35.58 38.18,34.25 38.21,34.23 | 38.21,34.23 38.21,34.11 v38.47,33.85 | 38.21,34.23 38.32,33.81 v38.47,33.85 | 38.21,34.23 38.56,33.98 v38.47,33.85
  Bottom 0.3: U4.7 24.85,5.68 R8.1 28.37,4.86 34.16,10.65 34.16,24.72 30.38,28.51 30.38,30.03 31.24,30.89 34.31,30.89 37.27,33.85 38.01,33.85 | v38.47,33.85 38.01,33.85 | 38.01,33.85 38.42,33.71 v38.47,33.85 | 38.01,33.85 38.42,34 v38.47,33.85
C_W  (via drill 0.3)
  Top 0.3: NUCLEO_MAIN.PA1 38.23,36.27 38.84,35.66 38.84,35.14 | v38.78,34.68 38.84,34.74 38.84,35.14 | 38.84,35.14 38.64,34.75 v38.78,34.68 | 38.84,35.14 38.93,34.72 v38.78,34.68
  Bottom 0.3: U4.1 18.13,4.89 R16.1 16.08,5.12 12.75,5.12 10.42,7.44 10.42,9.13 11.26,9.97 32.62,9.97 33.71,11.06 33.71,24.46 29.92,28.25 29.92,30.26 31.01,31.35 34.08,31.35 37.41,34.68 v38.78,34.68
CAN_L
  Top 0.5: U3.6 33.53,47.49 34.1,46.92 JP1.3
CANH
  Top 0.5: X2.5 24.8,47.74 25.83,48.77 27.93,48.77 29.52,47.18 31.84,47.18 32.26,47.6 U3.7
  Bottom 0.5: R22.2 25.25,46.92 X2.5
CANL
  Top 0.5: X2.6 27.34,46.38 33.07,46.38 33.54,45.9 JP1.2
  Bottom 0.5: X2.6 26.95,46.86 R22.1
CANRX  (via drill 0.35)  (1 unrouted)
  Top 0.3: NUCLEO_MAIN.PB9 33.84,27.14 33.84,29.42 32.34,30.92 32.34,33.88 33.62,35.16 33.62,35.39 | v33.62,35.92 33.62,35.39 | 33.62,35.39 33.79,35.86 v33.62,35.92 | 33.62,35.39 33.45,35.86 v33.62,35.92
  Bottom 0.3: v33.62,35.92 33.58,35.88 33.21,36.24 | 33.21,36.24 32.99,36.46 32.99,41.63 34.32,42.96 | 34.32,42.96 34.54,43.18 v34.8,43.18 | 33.21,36.24 33.47,35.83 v33.62,35.92 | 33.21,36.24 33.68,36.09 v33.62,35.92 | 34.32,42.96 34.82,43 v34.8,43.18 | 34.32,42.96 34.68,43.31 v34.8,43.18
CANTX  (via drill 0.35)  (1 unrouted)
  Top 0.3: NUCLEO_MAIN.PB8 33.34,27.14 33.34,29.22 31.83,30.73 31.83,34.3 32.56,35.03 | v32.93,35.4 32.56,35.03 | 32.56,35.03 33.01,35.24 v32.93,35.4 | 32.56,35.03 32.77,35.48 v32.93,35.4
  Bottom 0.3: v30.99,43.18 31.36,42.81 | 31.36,42.81 32.51,41.66 32.51,35.8 32.53,35.8 32.56,35.77 | v32.93,35.4 32.56,35.77 | 32.56,35.77 32.77,35.33 v32.93,35.4 | 32.56,35.77 33.01,35.56 v32.93,35.4 | 31.36,42.81 31.15,43.26 v30.99,43.18 | 31.36,42.81 30.92,43.02 v30.99,43.18
CLK  (via drill 0.35)
  Top 0.3: v30.78,33.97 30.66,34.08 31.02,34.43 | 31.02,34.43 32.87,36.29 NUCLEO_MAIN.PA5 | 31.02,34.43 30.66,34.1 v30.78,33.97 | 31.02,34.43 30.95,33.94 v30.78,33.97
  Bottom 0.3: v30.78,33.97 30.41,33.59 | 30.41,33.59 29.29,32.47 23.65,32.47 20.06,28.88 20.06,28.36 18.77,27.07 U2.2 | 30.41,33.59 30.85,33.81 v30.78,33.97 | 30.41,33.59 30.62,34.04 v30.78,33.97
CS  (via drill 0.35)
  Top 0.3: NUCLEO_MAIN.PB6 31.87,29.99 30.73,31.12 v29.72,31.12 | v29.72,31.12 | v29.72,31.12 29.78,31.29 30.24,31.12 29.78,30.96 v29.72,31.12
  Bottom 0.3: U2.1 18.8,26.42 20.6,28.22 20.6,28.78 23,31.18 29.72,31.18 v29.72,31.12 | v29.72,31.12 29.64,30.96 29.19,31.18 29.67,31.3 v29.72,31.12
DT
  Top 0.3: U1.DT 26.27,23.94 27.01,23.2 R7.2
G_
  Top 0.3: U$1.2 20.68,33.95 21.95,35.21 R24.3
GHA  (via drill 0.3)
  Top 0.3: U1.GHA 23.64,22.94 | 23.64,22.94 23.97,22.94 v24.08,22.83 | R5.1 34.53,14.92 34.53,18 33.81,18.73 29.63,18.73 26.76,21.6 26.32,22.38 | 26.32,22.38 26.24,22.45 v26.24,22.83 | 23.64,22.94 23.99,22.7 v24.08,22.83 | 23.64,22.94 24.06,22.98 v24.08,22.83 | 26.32,22.38 26.39,22.8 v26.24,22.83 | 26.32,22.38 26.11,22.75 v26.24,22.83
  Bottom 0.3: v26.24,22.83 | v26.24,22.83 25.79,22.83 | 25.79,22.83 24.54,22.83 | 24.54,22.83 v24.08,22.83 | 24.54,22.83 24.13,22.97 v24.08,22.83 | 24.54,22.83 24.13,22.68 v24.08,22.83 | 25.79,22.83 26.19,22.68 v26.24,22.83 | 25.79,22.83 26.19,22.97 v26.24,22.83
GHB  (via drill 0.35)
  Top 0.3: U1.GHB 21.23,22.2 21.23,21.66 | 21.23,21.66 21.23,21.57 21.39,21.41 v21.39,21.16 | v24.68,18.7 24.68,18.18 | 24.68,18.18 R3.1 | 21.23,21.66 21.21,21.17 v21.39,21.16 | v21.39,21.16 21.53,21.27 | 24.68,18.18 24.85,18.65 v24.68,18.7 | 24.68,18.18 24.51,18.65 v24.68,18.7
  Bottom 0.3: v24.68,18.7 24.68,19.23 | 24.68,19.23 24.68,20 23.52,21.16 21.91,21.16 | 21.91,21.16 v21.39,21.16 | 21.91,21.16 21.45,21.33 v21.39,21.16 | 21.91,21.16 21.45,21 v21.39,21.16 | 24.68,19.23 24.51,18.77 v24.68,18.7 | 24.68,19.23 24.85,18.77 v24.68,18.7
GHC  (via drill 0.35)
  Top 0.3: v15.89,21.2 15.89,20.68 | 15.89,20.68 15.89,15.09 R1.1 | U1.GHC 19.68,21.85 19.49,21.66 19.11,21.66 19.1,21.66 | 19.1,21.66 v18.73,21.29 | 15.89,20.68 16.06,21.14 v15.89,21.2 | 15.89,20.68 15.72,21.14 v15.89,21.2 | 19.1,21.66 18.66,21.45 v18.73,21.29 | 19.1,21.66 18.89,21.21 v18.73,21.29
  Bottom 0.3: v15.89,21.2 15.98,21.29 16.41,21.29 | v18.73,21.29 18.21,21.29 | 18.21,21.29 16.41,21.29 | 16.41,21.29 15.92,21.38 v15.89,21.2 | 16.41,21.29 15.98,21.05 v15.89,21.2 | 18.21,21.29 18.67,21.12 v18.73,21.29 | 18.21,21.29 18.67,21.46 v18.73,21.29
GLA
  Top 0.3: U1.GLA 18.95,23.39 18.48,23.39 17.14,22.05 17.14,19.58 17.37,19.35 25.09,19.35 25.73,18.71 25.73,15.23 R6.1
GLB
  Top 0.3: U1.GLB 18.95,23.89 18.34,23.89 16.55,22.1 16.55,14.83 16.66,14.71 R4.1
GLC
  Top 0.3: U1.GLC 18.22,24.44 15.88,22.09 11.5,22.09 7.91,18.5 R2.1
GND  (via drill 0.3, 0.35, 0.5, 0.6)  (1 unrouted)
  Top 0.3: v26.68,25.41 27.2,25.41 | C4.2 17.85,27.48 19.21,26.12 | 18.38,26.12 19.21,26.12 | 19.21,26.12 U1.GND 19.73,26.07 19.73,25.6 20.41,24.92 | 20.93,24.34 20.93,24.4 20.67,24.66 | 20.93,24.34 U1.PAD 21.23,24.48 | 20.41,24.92 20.67,24.66 | 21.23,24.48 21.31,24.57 | 21.31,24.57 21.59,24.85 v21.59,24.87 | 19.17,14.39 Q3.6 Q3.7 | 19.17,14.39 18.99,14.21 18.74,14.21 | 18.74,14.21 v18.29,14.21 | Q4.5 28.64,14.58 | 28.64,14.58 Q4.6 Q4.7 | X1.7 40.83,26.05 D6.C 40.49,24.3 S1.4 | REG.3 17.34,38.08 17.64,37.24 | 17.64,37.24 17.64,38.69 C18.2 16.97,39.4 | 27.71,40.2 27.87,40.03 NUCLEO_MAIN.VSS1 27.87,37.41 27.36,36.91 v27.36,36.72 | NUCLEO_MAIN.VREF- 35.87,34.77 33.79,36.84 | C23.2 31.89,41.79 31.89,42.71 | 31.89,42.71 v31.89,43.24 | D3.C 14.32,38.54 14.32,37.21 14.74,36.79 17.18,36.79 | NUCLEO_MAIN.VSS 34.37,38.06 | 34.37,38.06 34.37,37.81 34.08,37.53 33.77,37.53 v33.74,37.55 | 33.79,36.84 33.74,36.89 v33.74,37.55 | C15.2 22.19,31.34 23.76,29.77 NUCLEO_MAIN.VSS2 26.48,29.75 | C11.2 33.59,23.2 33.32,23.78 33.32,24.45 34.37,25.5 NUCLEO_MAIN.VSS3 34.37,33.7 33.91,34.17 33.91,34.34 | C11.2 32.9,22.7 R18.1 | C11.2 33.59,22.83 | v26.82,30.06 26.76,30 26.73,30 26.48,29.75 | 26.48,29.75 | Q2.5 10.01,15.19 10.01,15.01 | 10.01,15.01 10.01,14.92 | 10.01,14.92 10.01,14.9 9.94,14.22 | 9.94,14.22 v9.93,14.11 | v33.06,20.22 33.52,20.22 | 19.63,6.46 v19.67,6.5 | 21.23,24.48 21.67,24.71 v21.59,24.87 | 21.23,24.48 21.43,24.94 v21.59,24.87 | 27.2,25.41 26.71,25.58 26.68,25.5 v26.68,25.41 | 27.2,25.41 27.11,25.37 26.74,25.24 v26.68,25.41 | 31.89,42.71 32.05,43.18 v31.89,43.24 | 31.89,42.71 31.72,43.18 v31.89,43.24 | 19.17,14.39 18.33,14.51 v18.29,14.21
  Top 0.3: 19.17,14.39 18.44,13.95 v18.29,14.21 | 10.01,15.01 9.65,14.24 v9.93,14.11 | 10.01,15.01 10.22,14.19 v9.93,14.11 | 17.64,37.24 17.49,36.83 REG.3 | 17.64,37.24 17.71,37.05 17.72,37.03 17.72,37.02 | 17.72,37.02 17.73,36.99 17.75,36.94 | REG.3 17.72,37.02 | 17.18,36.79 17.29,36.75 REG.3 | 17.18,36.79 17.35,36.85 REG.3 | 26.48,29.75 26.88,29.92 v26.82,30.06 | 26.48,29.75 26.68,30.14 v26.82,30.06 | 33.52,20.22 33.11,20.36 v33.06,20.22 | 33.52,20.22 33.11,20.07 v33.06,20.22 | 10.01,14.92 9.17,14.96 v9.15,14.66 | 10.01,14.92 9.33,14.42 v9.15,14.66 | 9.94,14.22 9.38,14.86 v9.15,14.66 | 9.94,14.22 9.1,14.36 v9.15,14.66 | 18.74,14.21 19.2,14.04 v19.26,14.21 19.2,14.38 18.74,14.21 | 28.64,14.58 28.86,15.39 v28.56,15.47 28.29,15.35 28.64,14.58 | 20.93,24.34 21.1,24.81 v20.93,24.87 | 20.93,24.34 20.76,24.8 v20.93,24.87 | 20.41,24.92 20.85,24.71 v20.93,24.87 | 20.41,24.92 20.89,25.04 v20.93,24.87 | 20.67,24.66 20.76,24.18 v20.93,24.21 | 20.67,24.66 21.05,24.34 v20.93,24.21 | 21.31,24.57 20.86,24.37 v20.93,24.21 | 21.31,24.57 21.09,24.13 v20.93,24.21 | 18.38,26.12 17.95,25.88 v18.03,25.73 18.2,25.66 18.38,26.12 | 26.53,39.47 26.5,39.42 | 34.37,38.06 33.84,37.47 v33.74,37.55 | 33.79,36.84 33.95,37.5 v33.74,37.55 | 33.79,36.84 33.5,37.44 v33.74,37.55
  Top 0.5: Q2.5 9.98,15.01 | 9.98,15.01 Q2.7 | Q2.6 9.93,14.51 9.93,14.2 | 9.93,14.2 v9.93,14.11 | 9.98,15.01 9.73,14.17 v9.93,14.11 | 9.98,15.01 10.13,14.15 v9.93,14.11 | 9.93,14.2 9.29,14.81 v9.15,14.66 9.09,14.47 9.93,14.2 | 37.67,21.63 37.17,22.13 | 37.86,22.85 37.98,22.97
  Top 0.6: SJ1.2 38.68,19.79 S1.3 39.04,21.22
  Top 0.7: C18.2 18.96,39.36 C12.2 20.19,40.59 24.58,40.59 C14.2 | 31.16,41.6 C23.2 | v9.5,21.39 6.86,18.75 | 8.21,7.1 6.86,8.45 6.86,18.75 | 8.21,7.1 8.85,6.46 | 6.86,18.75 6.86,18.78 6.69,18.61 6.69,7.73 7.96,6.46 8.85,6.46 | 11.43,6.46 11.95,5.95 | 11.95,5.95 | 12,5.89 19.05,5.89 19.63,6.46 | 8.85,6.46 10.54,6.46 | 10.54,6.46 11.43,6.46 | 11.43,6.46 11.8,6.46 11.84,6.5 15.22,6.5 | 15.22,6.5 v19.67,6.5 18.39,5.23 15.88,5.23 15.19,5.23 12.75,5.23 11.77,5.23 10.54,6.46 | 8.21,7.1 14.63,7.1 15.22,6.5
  Top 1: 15.19,5.23 12.78,5.23 12.18,4.63 | 12.75,5.23 12.66,5.23 12,5.89 11.95,5.95 | 15.88,5.23 14.96,4.31 12.58,4.31 12.41,4.14 | SJ1.2 38.68,16.15 38.73,16.1 38.73,15.61 SJ2.2
  Bottom 0.3: C34.2 R17.1 21.84,4.64 20.33,6.15 | X2.3 19.72,46.23 | v30.99,48.48 30.99,47.96 | 30.99,47.96 30.99,46.6 31.89,45.71 31.89,43.76 | 31.89,43.76 v31.89,43.24 | 19.31,7.16 19.2,7.28 U4.4 18.21,7.34 R9.1 | 19.31,7.16 19.74,6.74 | 19.74,6.74 20.33,6.15 | v21.59,24.87 21.96,25.24 | 21.89,25.07 26.27,25.07 25.94,25.41 | U2.13 24.28,27.07 25.94,25.41 | 25.94,25.41 26.15,25.41 | 26.15,25.41 v26.68,25.41 | v26.82,30.06 26.93,30.06 27.19,29.8 | 27.7,29.29 27.19,29.8 | v19.67,6.5 19.67,6.67 19.74,6.74 | 33.91,34.34 32.21,34.34 29.89,36.66 | 21.96,25.24 21.52,25.03 v21.59,24.87 | 21.96,25.24 21.89,25.07 | 21.89,25.07 21.75,24.79 v21.59,24.87 | 26.15,25.41 26.62,25.24 v26.68,25.41 | 26.15,25.41 26.62,25.57 v26.68,25.41 | 30.99,47.96 31.16,48.42 v30.99,48.48 | 30.99,47.96 30.82,48.42 v30.99,48.48 | 31.89,43.76 31.72,43.3 v31.89,43.24 | 31.89,43.76 32.05,43.3 v31.89,43.24 | 27.19,29.8 26.94,30.15 v26.82,30.06 | 27.19,29.8 26.78,29.91 v26.82,30.06 | 19.31,7.16 19.42,6.47 v19.67,6.5 | 19.31,7.16 19.84,6.69 v19.67,6.5 | 20.33,6.15 19.85,6.67 v19.67,6.5 | 20.33,6.15 19.63,6.25 v19.67,6.5
  Bottom 0.5: C2.1 19.1,14.59 | 19.1,14.59 18.74,14.22 | 18.74,14.22 18.73,14.21 v18.29,14.21 | 28.52,16.68 28.52,18.33 28.66,18.47 | 28.52,16.68 28.52,16.37 | 28.52,16.37 C6.1 | 28.66,18.47 29.62,19.44 32.28,19.44 v33.06,20.22 | 19.1,14.59 18.25,14.41 v18.29,14.21 | 19.1,14.59 18.41,14.05 v18.29,14.21 | 18.74,14.22 19.25,14.13 v19.26,14.21 19.25,14.29 18.74,14.22 | 28.52,16.68 28.81,17.5 v28.62,17.57 | 28.52,16.68 28.42,17.55 v28.62,17.57 | 28.66,18.47 28.43,17.62 v28.62,17.57 | 28.66,18.47 28.82,17.61 v28.62,17.57 | 28.52,16.37 28.37,15.51 v28.56,15.47 28.76,15.53 28.52,16.37
  Bottom 1: 18.1,37.8 17.58,36.81 v17.54,36.85 17.54,36.82 18.87,35.49 18.87,34.6 | 18.1,37.8 19.42,39.12 19.42,45.92 19.72,46.23 19.72,47.5 18.23,48.99 12.39,48.99 D1.C D2.C | C6.1 25.92,17.32 18.63,17.32 18.93,17.02 | 9.68,17.02 9.93,16.78 v9.93,14.11 | 9.68,17.02 9.5,17.2 v9.5,21.39 C21.1 C20.1 C19.1 10.3,29.23 10.3,30.72 C17.1 C13.1 C22.1 9.76,37.97 17.93,37.97 18.1,37.8 | 18.93,17.02 9.68,17.02 | C2.1 19.23,16.71 18.93,17.02 | 18.87,34.6 18.87,33.97 17.11,33.97 v17.56,34.42 | v19.77,34.93 19.53,34.7 19.53,34.3 18.33,33.1 v17.94,33.1 19.45,34.6 18.87,34.6
  other vias: 8.81,16.18 19.41,15.88 17.46,15.88 17.43,16.88 17.4,18.55 8.81,17.47 10.62,19.94 12.28,18.74 26.58,17.03 28.62,16.54 26.6,16.02 27.41,14.56 26.6,18.14 18.32,15.13 9.47,18.79 19.74,17.04 20.53,18.55 20.27,24.87 20.27,23.55 21.59,23.55 20.27,24.21 21.59,24.21 20.93,23.55 25.41,26.39 24.89,24.58 29.91,25.3 31.57,20.22 32.98,22.31 32.98,24.09 18.03,25.07 10.61,27.75 9.19,22.83 15.19,22.83 16.31,27.69 13.71,27.78 12.29,22.83 12.26,24.72 9.22,24.69 15.16,24.66 18.73,41.11 21.56,42.9 23.94,41.87 21.12,39.57 23.31,39.64 34.4,35.29 32.55,42.58 32.52,43.47 33.36,33.45 33.33,32.56 25.27,37.59 20.98,37.77 20.57,31.79 16.9,34.88 16.9,33.96 18.92,18.49 28.93,21.71 14.72,21.32 11.76,21.26 13.51,19.97 10.99,17.44 29.13,40.37 26.81,42.93 29.94,42.93 31.83,40.32 26.64,39.3 26.55,37.15 13.73,23.72 13.75,25.64 10.68,25.64 10.71,23.75 29.6,37.53 28.91,35.92 30.95,37.58 30.49,32.56 27.36,34.51 34.42,41.46 35.86,38.82 34.17,30.18 31.21,29.66 29.17,29.29 28.14,30.35 35.63,31.19 25.49,20.12 35.67,42.57 26.5,35.81 31.9,22.34 29.89,23.45 24.23,37.61 19.11,39.15 21.99,33.42 14.61,36.93 14.11,38.77 23.06,36.9 20.31,37.24 13.3,39.44 19.23,31.75
  pour Top (no thermals): 26.99,18 29.06,18 29.06,13.7 26.99,13.7
  pour Top (no thermals): 16.97,16.43 19.78,16.43 19.78,13.73 16.97,13.73
  pour Top (no thermals): 8.36,19.5 10.45,19.5 10.45,13.67 8.36,13.67
  pour Bottom (no thermals): 8.39,19.47 29.37,19.47 29.37,13.35 25.58,13.35 25.58,16.87 20.41,16.87 20.41,13.24 16.28,13.24 16.28,16.47 11.6,16.47 11.6,13.18 10.05,13.18 8.39,14.85
  pour Bottom (no thermals): 18.78,48.03 20.82,48.03 20.84,48.06 20.84,45.36 24.23,41.98 24.23,35.06 20.62,31.44 16.54,31.44 16.54,18.09 8.39,18.09 8.39,39.71 17.95,39.71 17.95,47.2
  pour Top (no thermals): 24.15,26.7 25.84,26.7 26.9,25.64 31.01,25.64 31.01,24.49 31.18,24.32 32.5,24.32 33.22,25.04 33.22,26.16 34.51,26.16 34.51,23.75 37.29,23.75 37.29,28.22 41.63,28.22 41.63,23.8 40.17,23.8 40.17,21.05 36.38,21.05 36.38,19.74 29.89,19.74 29.89,20.01 25.84,24.06 24.15,24.06
  pour Bottom (no thermals): 17.6,25.99 23.26,25.99 23.26,32.24 36.75,32.24 36.75,19.01 25.38,19.01 25.01,18.64 25.01,22.38 19.88,22.38 17.6,24.66
  pour Top (no thermals): 10.29,28.06 18.19,28.06 22.14,24.12 22.14,21.79 10.29,21.79
  pour Top (no thermals): 16.62,40.63 19.2,43.21 31.29,43.21 31.95,43.87 35.09,43.87 39.07,39.89 28.7,39.89 27.72,38.91 20.21,38.91 17.5,36.2 13.24,36.2 13.24,40.63
  pour Bottom (no thermals): 20.56,44.44 27.76,44.44 28.74,45.42 28.74,49.7 31.61,49.7 32.87,48.44 32.87,41.86 32.16,41.14 32.16,37.67 28.98,34.49 19.6,34.49 19.6,43.48
  pour Bottom (no thermals): 33.86,42.85 36.23,42.85 36.23,33.94 34.19,31.9 28.54,31.9 28.54,37.53
  pour Top (no thermals): 32.93,34.6 34.74,34.6 34.74,30.41 34.65,30.32 34.65,29.09 34.02,29.09 32.67,30.44 32.67,34.34
  pour Top (no thermals): 16.6,38.44 16.6,33.89 20.02,30.46 21.77,30.46 21.77,29.6 26.11,29.6 26.11,38.44
  pour Top (no thermals): 25.04,20.53 26.62,20.53 29.08,18.06 29.08,17.52 29.06,17.49 29.06,15.65 28.85,15.45 26.04,15.45 26.04,18.84 25.27,19.61 25.04,19.61
  pour Top (no thermals): 16.94,19.01 21.1,19.01 21.1,17.66 19.78,16.34 16.97,16.34 16.94,16.37
  pour Bottom (no thermals): 17.66,9.42 19.04,9.42 19.24,9.22 19.24,8.01 22.88,5.52 22.88,3.97 23.14,3.71 24.38,3.71 24.43,3.65 24.43,2.67 24.4,2.7 21.22,2.7 21.1,2.82 21.1,4 19.04,6.06 19.04,6.84 18.84,7.04 17.54,7.04 17.54,9.31
  pour Top (no thermals): 8.84,21.77 15.3,21.77 15.3,20.99 10.45,16.14 10.22,16.14 8.84,17.52
  pour Top (no thermals): 10.61,28.06 -20.03,28.06 6.73,-3.87 16.91,6.32 16.91,6.75 16.94,6.78 15.53,6.78 14.84,7.47 8.73,7.47 7.24,8.96 7.24,18.41 10.61,21.78
  pour Top: 25.78,39.39 36.58,39.39 37.18,38.79 37.18,27.08 25.78,27.08
GVDD
  Top 0.3: U1.GVDD U1.MODE 20.41,26.35 20.41,26.96 18.68,28.69 17.82,28.69 17.62,28.89 | 9.66,45.81 R27.2
  Top 0.7: JP2.2 9.76,45.91 9.66,45.81
  Top 1: R27.2 9.09,43.28 11.68,40.7 11.68,32.63
  pour Top (no thermals): 3.76,46.17 10.42,46.17 10.6,45.99 10.6,43.1 12.81,40.88 12.81,33.31 16.08,30.03 19.21,30.03 20.76,28.48 20.76,26.57 20.1,26.57 18.34,28.34 0.66,28.34 0.66,43.07
GVDD_IN
  Top 0.3: X2.1 14.05,47.06 JP2.1
  pour Top (no thermals): 10.51,47.43 15.45,47.43 15.45,44.7 12.26,44.7 10.51,46.45
HA
  Top 0.3: Q4.1 34.49,13.27 R5.2
HB
  Top 0.3: Q3.1 24.49,13.27 R3.2
HC
  Top 0.3: Q2.1 15.27,13.27 R1.2
INA  (via drill 0.35)
  Top 0.3: U1.INHA 23.8,24.44 24.72,25.35 24.72,26.93 | 24.72,26.93 24.72,27.11 24.93,27.11 | 24.72,26.93 24.15,27.51 22.57,27.51 22.15,27.09 22.15,26.15 U1.INLA | NUCLEO_MAIN.PC7 26.2,34.27 27.48,32.99 27.48,29.8 27.24,29.57 | v25.44,27.25 25.29,27.11 24.93,27.11 | v26.87,29.2 | 27.24,29.57 v26.87,29.2 | 24.93,27.11 25.43,27.07 v25.44,27.25 | 24.93,27.11 25.33,27.39 v25.44,27.25 | 27.24,29.57 26.8,29.36 v26.87,29.2 | 27.24,29.57 27.03,29.12 v26.87,29.2
  Bottom 0.3: 25.45,27.77 25.44,27.77 v25.44,27.25 | 25.45,27.77 26.5,28.83 | 26.5,28.83 v26.87,29.2 | 25.45,27.77 25.27,27.31 v25.44,27.25 | 25.45,27.77 25.61,27.31 v25.44,27.25 | 26.5,28.83 26.95,29.04 v26.87,29.2 | 26.5,28.83 26.71,29.28 v26.87,29.2
INB  (via drill 0.35)
  Top 0.3: U1.INHB 22.89,24.91 23.55,24.91 24.26,25.63 24.26,26.63 23.9,26.99 23.11,26.99 | 23.11,26.99 23.1,26.99 22.74,26.63 v22.81,26.56 | v21.82,27.65 21.64,27.47 21.64,27.16 | 21.64,27.16 21.64,26.16 U1.INLB | v21.82,27.65 22.19,28.02 | 22.19,28.02 22.25,28.08 25.81,28.08 26.23,27.66 26.23,26.93 27.1,26.06 30.65,26.06 30.87,26.29 NUCLEO_MAIN.PB4 | 23.11,26.99 22.71,26.7 v22.81,26.56 | 23.11,26.99 22.98,26.51 v22.81,26.56 | 21.64,27.16 21.64,27.65 v21.82,27.65 | 22.19,28.02 21.74,27.81 v21.82,27.65 | 22.19,28.02 21.98,27.57 v21.82,27.65
  Bottom 0.3: 22.42,26.91 22.77,26.56 v22.81,26.56 | 22.42,26.91 22.11,27.21 | 22.11,27.21 21.82,27.51 v21.82,27.65 | 22.42,26.91 22.66,26.47 v22.81,26.56 | 22.42,26.91 22.88,26.72 v22.81,26.56 | 22.11,27.21 21.99,27.69 v21.82,27.65 | 22.11,27.21 21.71,27.51 v21.82,27.65
INC  (via drill 0.35)
  Top 0.3: U1.INHC 22.9,25.47 23.24,25.82 v23.34,25.73 | 23.1,25.73 v23.34,25.73 | 21.12,28.18 21.12,28.21 v21.48,28.57 | 21.12,28.18 21.12,26.84 21.18,26.78 U1.INLC | NUCLEO_MAIN.PB10 28.87,37.69 28.19,37 28.19,34.97 29,34.16 29,30.23 27.33,28.57 22,28.57 | v21.48,28.57 22,28.57 | v23.34,25.73 23.36,25.71 | 21.12,28.18 21.56,28.41 v21.48,28.57 | 21.12,28.18 21.32,28.64 v21.48,28.57 | 22,28.57 21.54,28.73 v21.48,28.57 | 22,28.57 21.54,28.4 v21.48,28.57
  Bottom 0.3: 21.19,28.13 21.19,27.29 22.75,25.73 v23.34,25.73 | 21.19,28.13 21.19,28.28 v21.48,28.57 | 21.19,28.13 21.59,28.43 v21.48,28.57 | 21.19,28.13 21.31,28.61 v21.48,28.57
L
  Top 0.3: D3.A R20.1
LA
  Top 0.3: Q4.8 28.39,13.02 R6.2
LB
  Top 0.3: Q3.8 19.1,13.02 R4.2
LC
  Top 0.3: Q2.8 9.73,13.02 R2.2
LED  (via drill 0.35)
  Top 0.3: NUCLEO_MAIN.PC14 36.97,30.22 35.92,30.22 35.37,29.67 35.37,25.53 35.61,25.29 | v36.09,25.07 35.8,25.07 35.58,25.29 | 35.58,25.29 35.95,24.93 v36.09,25.07 | 35.58,25.29 35.61,25.29 | 35.61,25.29 36.1,25.25 v36.09,25.07
  Bottom 0.3: 40.68,20.24 40.83,20.08 R23.2 | R23.2 40.83,22.12 38.01,24.95 | 40.68,20.24 40.66,19.75 R23.2 | 40.68,20.24 40.98,19.85 R23.2
  Bottom 0.32: v36.09,25.07 37.89,25.07 38.01,24.95
  other vias: 40.83,19.74
LEDB
  Top 0.3: NUCLEO_MAIN.PB13 R24.8
LEDG
  Top 0.3: R24.6 23.74,35.26 24.53,35.26 24.53,35.27 NUCLEO_MAIN.PB15
LEDR
  Top 0.3: NUCLEO_MAIN.PB14 25.17,35.72 24.35,35.72 24.34,35.71 R24.7
MISO  (via drill 0.35)
  Top 0.3: v30.26,34.66 30.29,34.66 30.65,35.01 | 30.65,35.01 32.37,36.74 NUCLEO_MAIN.PA6 | 30.65,35.01 30.19,34.82 v30.26,34.66 | 30.65,35.01 30.42,34.57 v30.26,34.66
  Bottom 0.3: U2.3 18.69,27.72 19.56,28.59 19.56,29.02 23.59,33.05 28.65,33.05 29.89,34.28 | 29.89,34.28 v30.26,34.66 | 29.89,34.28 30.34,34.49 v30.26,34.66 | 29.89,34.28 30.1,34.73 v30.26,34.66
MOSI  (via drill 0.35)
  Top 0.3: NUCLEO_MAIN.PA7 31.87,37.44 30.11,35.68 | 30.11,35.68 29.74,35.31 v29.69,35.37 | 30.11,35.68 29.64,35.54 v29.69,35.37 | 30.11,35.68 29.83,35.27 v29.69,35.37
  Bottom 0.3: v29.69,35.37 29.32,35 | 29.32,35 27.94,33.62 23.46,33.62 19.06,29.23 19.06,28.73 18.7,28.37 U2.4 | 29.32,35 29.76,35.21 v29.69,35.37 | 29.32,35 29.53,35.45 v29.69,35.37
N$8
  Bottom 0.3: U4.5 23.87,7.25 25.67,7.25 R8.2 26.87,6.56 R11.1
N$9
  Bottom 0.3: R9.2 21.96,8.88 | 21.96,8.88 R12.1 | U4.6 23.27,6.48 21.96,7.79 21.96,8.88
N$10
  Bottom 0.3: U4.3 18.12,6.5 16.39,6.5 R16.2 14.89,6.59 R14.1
N$11
  Bottom 0.3: R15.1 20.01,3.16 | 20.01,3.16 R17.2 | U4.2 19.02,5.68 20.01,4.68 20.01,3.16
N$14  (via drill 0.35)
  Top 0.7: R19.1 11.34,43.49 v11.34,44.07
  Bottom 0.3: D1.A 11.34,46.19 11.34,44.59 | 11.34,44.59 v11.34,44.07 | 11.34,44.59 11.17,44.13 v11.34,44.07 | 11.34,44.59 11.5,44.13 v11.34,44.07
N$15  (via drill 0.35)
  Bottom 0.3: D2.A 8.8,45.24 7.92,45.24 | 7.92,45.24 R27.1 | 7.92,45.24 7.45,45.4 R27.1 | 7.92,45.24 7.45,45.07 R27.1
  other vias: 7.39,45.24
N$21
  Top 0.3: D6.A R23.1
NRST
  Top 0.3: X1.3 39.37,35.22 39.37,32.6 38.93,32.16 | 38.93,32.16 R21.2 | NUCLEO_MAIN.NRST 38.82,32.27 38.93,32.16
PVDD  (via drill 0.6, 0.8)  (2 unrouted)
  Top 0.3: Q2.10 12.29,14.81 | 12.29,14.81 12.29,15.66 | 12.29,15.87 v12.29,15.88 | Q2.3 13.26,14.71 12.93,15.04 | 12.93,15.04 12.9,15.07 | v12.29,15.88 12.72,15.45 12.9,15.07 | Q2.4 13.26,14.84 | 13.26,14.84 Q2.3 | Q2.2 13.37,14.02 | 13.37,14.02 13.42,14.07 | 13.42,14.07 13.59,14.24 13.44,14.39 | 13.44,14.39 Q2.3 | Q3.4 22.63,15.15 | 22.63,15.15 22.63,14.8 | 22.63,14.8 Q3.3 22.63,14.48 | 22.63,14.48 Q3.2 | Q4.4 Q4.3 | Q4.3 Q4.2 | JP2.3 8.75,47.71 10.25,49.21 16.16,49.21 16.97,48.41 16.97,46.68 X2.2 17.18,45.77 15.76,44.36 12.17,44.36 R19.2 | v30.48,17.87 30.48,16.97 | 30.48,16.97 30.48,16 | Q4.3 31.45,15.03 31.44,15.06 | 12.29,14.81 12.6,15.77 v12.29,15.88 | 12.29,14.81 11.93,15.73 | 12.9,15.07 12.09,15.45 v12.29,15.88 | 30.48,16.97 30.76,17.77 v30.48,17.87 | 30.48,16.97 30.19,17.77 v30.48,17.87 | 12.29,15.66 11.98,14.87 12.26,14.76 12.55,14.85 12.29,15.66 | 12.93,15.04 13.96,14.44 v14.21,14.88 | 12.93,15.04 14.16,15.24 v14.21,14.88 | 13.42,14.07 14.12,14.76 14.12,14.79 v14.21,14.88 | 13.42,14.07 13.52,14.95 v14.21,14.88 | 22.63,14.48 23.25,13.91 v23.46,14.13 23.48,14.43 22.63,14.48 | 22.63,15.15 22.99,16.08 v22.72,16.19 22.33,16.06 22.63,15.15 | 22.63,14.8 23.48,14.77 v23.49,15.08 23.3,15.32 22.63,14.8 | 13.26,14.84 13.6,15.78 v13.43,15.84 12.97,15.67 13.26,14.84 | 13.37,14.02 14.34,13.7 v14.37,13.81 | 13.37,14.02 14.17,14.33 v14.37,13.81 | 13.44,14.39 14.24,13.66 v14.37,13.81 | 13.44,14.39 14.4,14.34 v14.37,13.81 | v30.51,16.94 30.5,16.92
  Bottom 0.3: C5.2 13.34,14.84 | 13.34,14.84 12.97,15.21 | 12.47,15.71 12.38,15.8 | 12.97,15.21 12.47,15.71 | 12.47,15.71 12.37,15.71 | C6.2 31.58,15.17 | 30.48,16.27 30.48,16.54 | 30.48,16.54 30.48,16.57 30.48,16.71 30.48,16.97 | 30.48,16.97 v30.48,17.87 | 30.48,16.97 30.76,17.77 v30.48,17.87 | 30.48,16.97 30.19,17.77 v30.48,17.87 | 12.97,15.21 13.84,14.45 v14.21,14.88 14.22,15.16 12.97,15.21 | 13.34,14.84 13.59,15.79 v13.43,15.84 | 13.34,14.84 12.98,15.63 v13.43,15.84 | 12.37,15.71 13.3,15.41 v13.43,15.84 | 12.37,15.71 12.79,15.88 | v13.43,15.84 13.34,16.09 | 30.48,16.54 30.49,16.46
  Bottom 1: C6.2 32.03,13.22 30.96,12.15 22.65,12.15 | 22.65,12.15 13.44,12.15 | 13.44,12.15 8.62,12.15 5.99,14.77 C21.2 C20.2 C19.2 C17.2 C13.2 C22.2 5.99,40.18 6.69,40.88 12.86,40.88 17.18,45.2 X2.2 | C5.2 13.38,12.21 13.44,12.15 | C2.2 22.74,12.24 22.65,12.15
  other vias: 14.3,11.98 14.48,15.87 12.32,11.98 21.56,16.22 23.74,11.2 23.8,16.08 25.01,11.23 32.92,17.9 32.92,14.21 31.28,16.27 31.71,11.85 32.8,12.34 13.29,11.98 32.86,15.39 31.71,17.84 22.8,11.69 32.91,16.67
  pour Top (no thermals): 11.83,16.31 15.48,16.31 15.48,11.43 11.83,11.43
  pour Bottom (no thermals): 11.89,12.89 11.89,16.18 16.02,16.18 16.02,12.98 20.7,12.98 20.7,16.61 25.32,16.61 25.32,13.1 29.63,13.1 29.63,18.75 33.48,18.75 33.48,11.17 32.5,10.2 8.1,10.2 8.1,14.7 9.91,12.89
  pour Bottom (no thermals): 8.59,10.34 3.25,10.34 -1.15,14.73 -1.15,44.27 15.07,44.27 15.88,45.08 15.88,48.03 17.68,48.03 17.68,39.99 8.13,39.99 8.13,14.1 8.59,13.64
  pour Top (no thermals): 21.13,16.83 25.52,16.83 25.52,10.8 23.11,10.8 21.13,12.78
  pour Top (no thermals): 9.02,46.45 6.68,46.45 6.68,49.67 18.03,49.67 18.03,43.2 15.88,43.2 15.88,47.69 9.02,47.69
  pour Top (no thermals): 30.03,18.56 33.96,18.56 33.96,11.34 33.94,11.32 31.67,11.32 30.43,12.55 30.43,15.77 30.09,15.77 30.03,15.82
R_  (1 unrouted)
  Top 0.3: 22.64,35.73 21.82,35.73 21.19,35.09 20.92,35.09 19.23,33.41 U$1.3
SW  (1 unrouted)
  Top 0.3: NUCLEO_MAIN.PC13 36.17,29.77 35.85,29.44 35.85,26.21 36.81,25.25 36.81,24.38 S1.2
SWCLK  (via drill 0.35)
  Top 0.3: v31.24,28.57 30.71,28.57 | 30.71,28.57 27.99,28.57 27.37,27.95 NUCLEO_MAIN.PA14 | 30.71,28.57 31.18,28.4 v31.24,28.57 | 30.71,28.57 31.18,28.74 v31.24,28.57
  Bottom 0.3: X1.5 36.79,31.37 34.02,28.6 31.76,28.6 | v31.24,28.57 31.27,28.6 31.76,28.6 | 31.76,28.6 31.29,28.74 v31.24,28.57 | 31.76,28.6 31.31,28.41 v31.24,28.57
SWDIO  (via drill 0.35)
  Top 0.3: NUCLEO_MAIN.PA13 25.23,30.27 26.13,30.27 26.55,30.69 26.55,31.32 | v26.53,31.84 26.55,31.83 26.55,31.32 | 26.55,31.32 26.7,31.79 v26.53,31.84 | 26.55,31.32 26.36,31.78 v26.53,31.84
  Bottom 0.3: 27.05,31.84 33.78,31.84 37.34,35.4 39.04,35.4 40.53,33.91 X1.4 | 27.05,31.84 v26.53,31.84 | 27.05,31.84 26.59,32.01 v26.53,31.84 | 27.05,31.84 26.59,31.67 v26.53,31.84
U  (via drill 0.35)
  Top 0.3: U1.SHC 17.93,21.87 17.93,20.68 | 17.93,20.68 17.93,20.45 18.14,20.25 18.14,20.19 v18.12,20.19 | Q2.9 10.98,14.33 11,14.34 11,15.94 14.86,19.8 | v18.12,20.19 C1.2 | v15.25,20.16 15.22,20.16 14.86,19.8 | 11.07,9.5 10.45,9.5 R13.2 | 17.93,20.68 17.95,20.19 v18.12,20.19 | 17.93,20.68 18.26,20.31 v18.12,20.19 | 14.86,19.8 15.32,20 v15.25,20.16 | 14.86,19.8 15.09,20.24 v15.25,20.16
  Top 1: v11.27,8.59 11.07,8.8 11.07,9.5 Q2.9
  Bottom 0.3: v11.27,8.59 11.27,8.07 | 11.27,8.07 11.27,7.7 12.16,6.82 R14.2 | v18.12,20.19 17.6,20.19 | 17.6,20.19 15.77,20.19 | 15.77,20.19 15.25,20.19 v15.25,20.16 | 11.27,8.07 11.43,8.53 v11.27,8.59 | 11.27,8.07 11.1,8.53 v11.27,8.59 | 17.6,20.19 18.06,20.03 v18.12,20.19 | 17.6,20.19 18.06,20.36 v18.12,20.19 | 15.77,20.19 15.29,20.33 v15.25,20.16 | 15.77,20.19 15.32,20 v15.25,20.16
  pour Top (no thermals): 10.74,15.65 11.54,15.65 11.54,7.76 8.82,7.76 7.58,8.99 7.58,12.15 9.36,12.15 10.74,13.53
U_CS
  Top 0.3: R13.1 16.04,11.54 16.85,11.54 | ..6 21.33,8.01 21.5,8.01 ..7
  Top 1: 21.5,8.01 21.5,6.61 18.69,3.79 18.69,1.71 JP3.3 | R13.1 14.8,10.31 20.53,10.31 21.33,9.51 21.33,8.01
  Bottom 0.3: JP3.3 17.5,1.44 16.41,2.53 R15.2
  pour Top (no thermals): 13.5,11.17 20.24,11.17 22.22,9.19 22.22,8.16 20.73,8.16 20.73,8.96 20.53,9.16 15.25,9.16 15.25,7.78 13.52,7.78 13.5,7.81
  pour Top (no thermals): 15.25,11 15.48,11 15.73,11.26 15.73,12.12 19.78,12.12 19.78,10.6 15.25,10.6
USBRX
  Top 0.3: X1.1 40.26,41.19 36.4,41.19 34.87,39.67 NUCLEO_MAIN.PA3
  Top 0.5: X1.1 38.66,43.47 37.3,43.47 35.89,44.88 JP1.1
USBTX
  Top 0.3: X1.2 38.37,36.77 NUCLEO_MAIN.PA2
V  (via drill 0.35)
  Top 0.3: U1.SHB 20.68,20.95 21.19,20.44 | C3.2 21.65,20.07 v21.61,20.11 | v21.61,20.11 21.52,20.11 21.19,20.44 | Q3.9 20.43,16.44 21.73,17.75 21.73,18.2 | 21.73,18.2 v21.73,18.72 | 23.4,7.42 23.4,7.5 | 23.4,7.5 23.4,7.6 ..8 23.49,8.01 ..9 23.48,7.5 23.4,7.5 | 21.73,18.2 21.9,18.66 v21.73,18.72 | 21.73,18.2 21.57,18.66 v21.73,18.72 | 21.19,20.44 21.45,20.02 v21.61,20.11 | 21.19,20.44 21.66,20.28 v21.61,20.11
  Top 1: Q3.9 20.43,12.47 23.49,9.42 23.49,8.01 | JP3.2 20.96,3.51 23.4,5.95 23.4,7.42
  Bottom 0.3: v21.61,20.11 21.73,19.99 21.73,19.61 | 21.73,19.61 21.73,19.25 | 21.73,19.25 v21.73,18.72 | 21.73,19.25 21.57,18.78 v21.73,18.72 | 21.73,19.25 21.9,18.78 v21.73,18.72 | 21.73,19.61 21.78,20.1 v21.61,20.11 | 21.73,19.61 21.46,20.02 v21.61,20.11
  pour Top (no thermals): 20.04,14.1 20.87,14.1 20.87,12.58 22.97,10.48 24.06,10.48 24.23,10.31 24.23,8.67 22.74,8.67 22.74,9.08 20.33,11.49 20.04,11.49
VCAP
  Top 0.3: NUCLEO_MAIN.VCAP_1 28.37,40.34 28.02,40.68 26.7,40.68 C14.1
VDDA
  Top 0.3: BEAD.1 36.68,38.2 35.86,37.38 35.86,35.55 36.17,35.24 36.99,35.24 NUCLEO_MAIN.VREF+
W  (via drill 0.35)
  Top 0.3: U1.SHA 23.1,21.33 C7.2 26.33,21.33 29.6,18.05 29.6,14.36 Q4.9 | R10.2 31.57,8.98 31.09,8.5 | 31.09,8.5 v30.72,8.13 | 31.09,8.5 30.64,8.29 v30.72,8.13 | 31.09,8.5 30.88,8.05 v30.72,8.13
  Top 1: Q4.9 29.72,12.17
  Bottom 0.3: v30.72,8.13 30.14,8.13 R11.2 | v30.72,8.13 30.66,7.96 30.2,8.13 30.66,8.3 v30.72,8.13
  pour Top (no thermals): 29.31,13.1 29.31,11.4 29.49,11.4 29.8,11.09 29.8,7.67 31.47,7.67 31.47,11.09 31.5,11.11 30.17,12.44 30.17,13.04 29.37,13.04
W_CS  (via drill 0.3)
  Top 0.3: ..11 25.47,8.01 ..10 24.99,8.05 25.09,8.15 | R10.1 27.38,9.4 | 25.09,8.15 25.87,8.52 v25.51,9.28 25.6,9.24 25.09,8.15
  Top 1: 27.38,9.4 ..11 | 25.47,8.01 25.47,5.53 23.5,3.56 JP3.1
  Bottom 0.3: R12.2 25,8.88 25.09,8.8 25.25,8.72 v25.51,9.28
  pour Top (no thermals): 25.81,12.26 29,12.26 29,9.59 29,7.24 27.85,7.24 27.48,6.87 26.5,5.89 24.75,5.89 24.75,10.51 25.7,10.51 25.81,10.51

### Text on the board
tPlace: G+ | P+ | GND | +5V | CH | CL | Designed By Daiki Tomioka | V1.3 | GVDD | GND | A | B
bPlace: GVDD | PVDD | Supported by | 00 : 0 / 01 : 1 / 10 : 2 / 11 : 3